# Altium project CT310高端控制盒基板电路V1.1.PrjPcb (part 1 of 2)
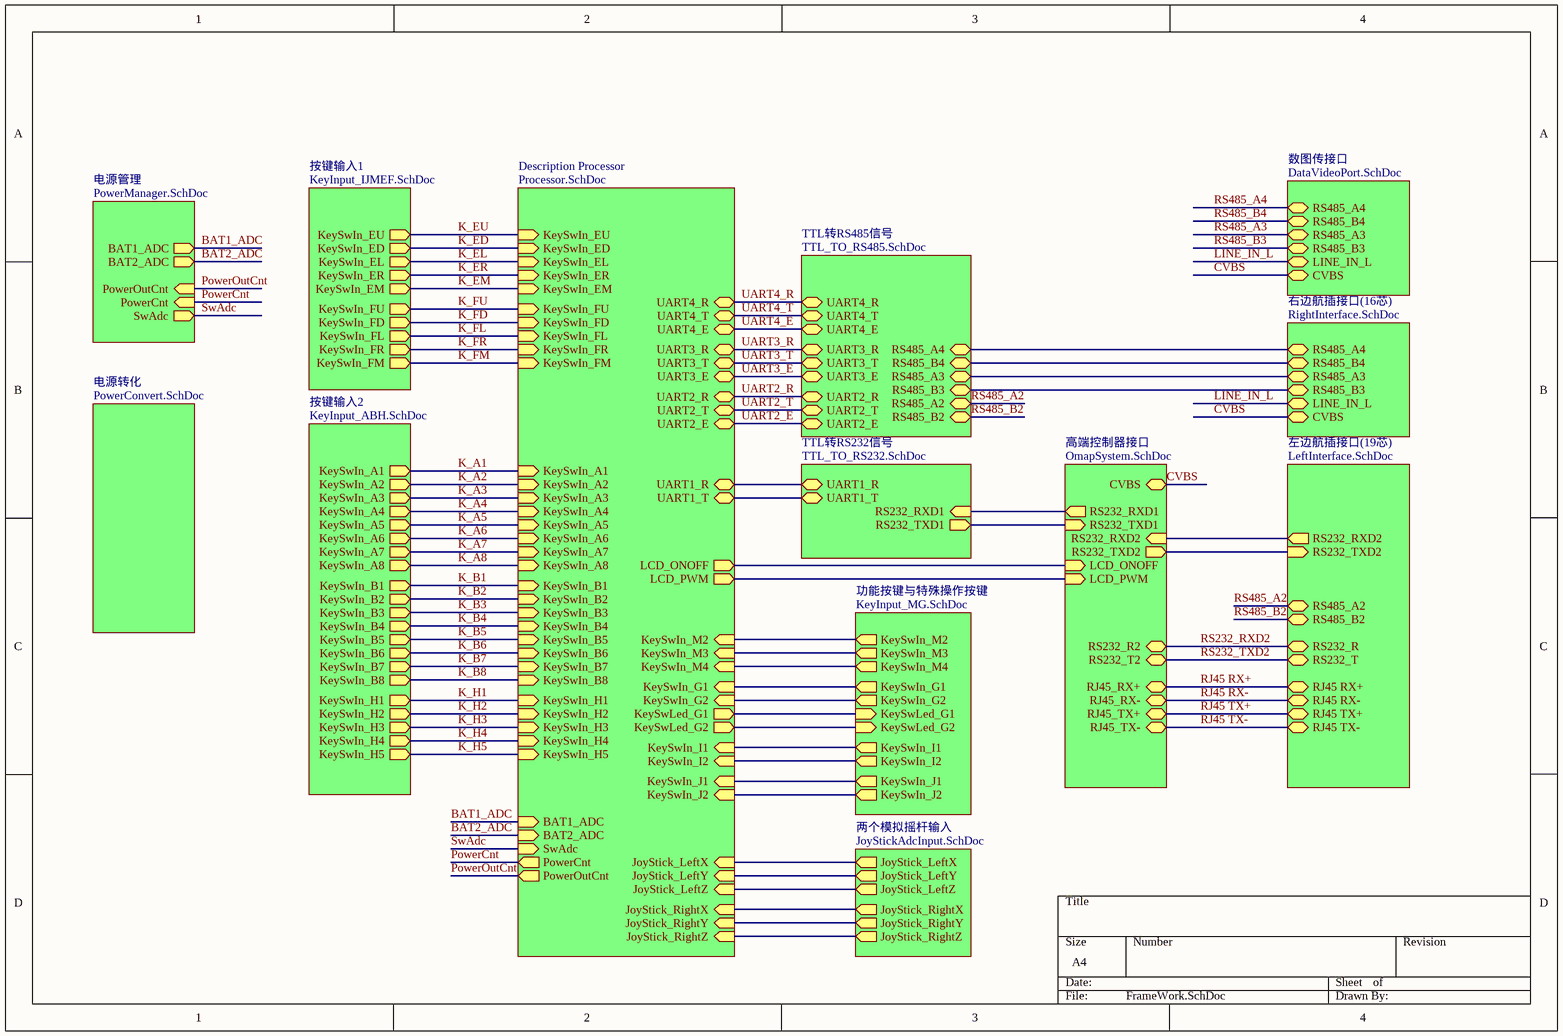
[diagram p0: FrameWork.SchDoc]
13 sheets, 273 parts. Net scope: global (net labels, ports and power ports of the same name join across sheets).
Board file: CT310高端控制盒基板电路V1.1.PcbDoc
Sheets:
  FrameWork.SchDoc
    Description Processor = Processor.SchDoc
    按键输入1 = KeyInput_IJMEF.SchDoc
    两个模拟摇杆输入 = JoyStickAdcInput.SchDoc
    按键输入2 = KeyInput_ABH.SchDoc
    高端控制器接口 = OmapSystem.SchDoc
    功能按键与特殊操作按键 = KeyInput_MG.SchDoc
    电源管理 = PowerManager.SchDoc
    左边航插接口(19芯) = LeftInterface.SchDoc
    TTL转RS232信号 = TTL_TO_RS232.SchDoc
    TTL转RS485信号 = TTL_TO_RS485.SchDoc
    电源转化 = PowerConvert.SchDoc
    数图传接口 = DataVideoPort.SchDoc

## Sheet FrameWork.SchDoc
size A4

### Sub-sheets
Description Processor = Processor.SchDoc: KeySwIn_EU (in), KeySwIn_ED (in), KeySwIn_EL (in), KeySwIn_ER (in), KeySwIn_EM (in), KeySwIn_FU (in), KeySwIn_FD (in), KeySwIn_FL (in), KeySwIn_FR (in), KeySwIn_FM (in), KeySwIn_A2 (in), KeySwIn_A3 (in), KeySwIn_A4 (in), KeySwIn_A5 (in), KeySwIn_A6 (in), KeySwIn_A7 (in), KeySwIn_A8 (in), KeySwIn_A1 (in), KeySwIn_B2 (in), KeySwIn_B3 (in), KeySwIn_B4 (in), KeySwIn_B5 (in), KeySwIn_B6 (in), KeySwIn_B7 (in), KeySwIn_B8 (in), KeySwIn_B1 (in), KeySwIn_H2 (in), KeySwIn_H3 (in), KeySwIn_H4 (in), KeySwIn_H5 (in), KeySwIn_H1 (in), JoyStick_LeftX (in), JoyStick_LeftY (in), JoyStick_LeftZ (in), JoyStick_RightX (in), JoyStick_RightY (in), JoyStick_RightZ (in), UART1_T (bidir), UART1_R (bidir), UART3_T (bidir), UART3_R (bidir), UART3_E (bidir), UART2_T (bidir), UART2_R (bidir), UART4_T (bidir), UART4_R (bidir), UART4_E (bidir), UART2_E (bidir), BAT2_ADC (in), BAT1_ADC (in), KeySwIn_M3 (in), KeySwIn_M4 (in), KeySwIn_M2 (in), KeySwIn_G1 (in), KeySwIn_G2 (in), KeySwLed_G1 (out), KeySwLed_G2 (out), KeySwIn_I1 (in), KeySwIn_I2 (in), KeySwIn_J1 (in), KeySwIn_J2 (in), SwAdc (in), PowerCnt (out), LCD_ONOFF (out), LCD_PWM (out), PowerOutCnt (out)
TTL转RS232信号 = TTL_TO_RS232.SchDoc: RS232_RXD1 (in), UART1_T (bidir), UART1_R (bidir), RS232_TXD1 (out)
TTL转RS485信号 = TTL_TO_RS485.SchDoc: UART3_T (bidir), UART3_R (bidir), RS485_B3 (bidir), RS485_A3 (bidir), RS485_B4 (bidir), RS485_A4 (bidir), UART3_E (bidir), UART2_T (bidir), UART2_R (bidir), UART4_T (bidir), UART4_R (bidir), UART4_E (bidir), UART2_E (bidir), RS485_B2 (bidir), RS485_A2 (bidir)
两个模拟摇杆输入 = JoyStickAdcInput.SchDoc: JoyStick_LeftX (out), JoyStick_LeftY (out), JoyStick_LeftZ (out), JoyStick_RightX (out), JoyStick_RightY (out), JoyStick_RightZ (out)
功能按键与特殊操作按键 = KeyInput_MG.SchDoc: KeySwIn_M2 (out), KeySwIn_M3 (out), KeySwIn_M4 (out), KeySwIn_G2 (out), KeySwLed_G1 (in), KeySwIn_G1 (out), KeySwLed_G2 (in), KeySwIn_I1 (out), KeySwIn_I2 (out), KeySwIn_J1 (out), KeySwIn_J2 (out)
右边航插接口(16芯) = RightInterface.SchDoc (file not in this document): RS485_B4 (bidir), RS485_A4 (bidir), RS485_B3 (bidir), RS485_A3 (bidir), CVBS (bidir), LINE_IN_L (bidir)
左边航插接口(19芯) = LeftInterface.SchDoc: RS232_T (bidir), RS232_R (bidir), RS485_B2 (bidir), RS485_A2 (bidir), RJ45 RX+ (bidir), RJ45 TX+ (bidir), RJ45 RX- (bidir), RJ45 TX- (bidir), RS232_RXD2 (out), RS232_TXD2 (in)
按键输入1 = KeyInput_IJMEF.SchDoc: KeySwIn_EU (out), KeySwIn_ED (out), KeySwIn_EL (out), KeySwIn_ER (out), KeySwIn_EM (out), KeySwIn_FU (out), KeySwIn_FD (out), KeySwIn_FL (out), KeySwIn_FR (out), KeySwIn_FM (out)
按键输入2 = KeyInput_ABH.SchDoc: KeySwIn_A1 (out), KeySwIn_A2 (out), KeySwIn_A3 (out), KeySwIn_A4 (out), KeySwIn_A5 (out), KeySwIn_A6 (out), KeySwIn_A7 (out), KeySwIn_A8 (out), KeySwIn_B1 (out), KeySwIn_B2 (out), KeySwIn_B3 (out), KeySwIn_B4 (out), KeySwIn_B5 (out), KeySwIn_B6 (out), KeySwIn_B7 (out), KeySwIn_B8 (out), KeySwIn_H1 (out), KeySwIn_H2 (out), KeySwIn_H3 (out), KeySwIn_H4 (out), KeySwIn_H5 (out)
数图传接口 = DataVideoPort.SchDoc: RS485_B4 (bidir), RS485_A4 (bidir), RS485_B3 (bidir), RS485_A3 (bidir), CVBS (bidir), LINE_IN_L (bidir)
电源管理 = PowerManager.SchDoc: BAT2_ADC (out), BAT1_ADC (out), PowerCnt (in), SwAdc (out), PowerOutCnt (in)
电源转化 = PowerConvert.SchDoc: no entries
高端控制器接口 = OmapSystem.SchDoc: RJ45_RX+ (bidir), RJ45_TX+ (bidir), RJ45_RX- (bidir), RJ45_TX- (bidir), RS232_T2 (bidir), RS232_R2 (bidir), RS232_RXD1 (out), RS232_TXD1 (in), CVBS (bidir), LCD_ONOFF (in), LCD_PWM (in), RS232_RXD2 (in), RS232_TXD2 (out)

### Nets
BAT1_ADC: sheet Description Processor/BAT1_ADC, sheet 电源管理/BAT1_ADC
BAT2_ADC: sheet Description Processor/BAT2_ADC, sheet 电源管理/BAT2_ADC
CVBS: sheet 高端控制器接口/CVBS, sheet 右边航插接口(16芯)/CVBS, sheet 数图传接口/CVBS
K_A1: sheet Description Processor/KeySwIn_A1, sheet 按键输入2/KeySwIn_A1
K_A2: sheet Description Processor/KeySwIn_A2, sheet 按键输入2/KeySwIn_A2
K_A3: sheet Description Processor/KeySwIn_A3, sheet 按键输入2/KeySwIn_A3
K_A4: sheet Description Processor/KeySwIn_A4, sheet 按键输入2/KeySwIn_A4
K_A5: sheet Description Processor/KeySwIn_A5, sheet 按键输入2/KeySwIn_A5
K_A6: sheet Description Processor/KeySwIn_A6, sheet 按键输入2/KeySwIn_A6
K_A7: sheet Description Processor/KeySwIn_A7, sheet 按键输入2/KeySwIn_A7
K_A8: sheet Description Processor/KeySwIn_A8, sheet 按键输入2/KeySwIn_A8
K_B1: sheet Description Processor/KeySwIn_B1, sheet 按键输入2/KeySwIn_B1
K_B2: sheet Description Processor/KeySwIn_B2, sheet 按键输入2/KeySwIn_B2
K_B3: sheet Description Processor/KeySwIn_B3, sheet 按键输入2/KeySwIn_B3
K_B4: sheet Description Processor/KeySwIn_B4, sheet 按键输入2/KeySwIn_B4
K_B5: sheet Description Processor/KeySwIn_B5, sheet 按键输入2/KeySwIn_B5
K_B6: sheet Description Processor/KeySwIn_B6, sheet 按键输入2/KeySwIn_B6
K_B7: sheet Description Processor/KeySwIn_B7, sheet 按键输入2/KeySwIn_B7
K_B8: sheet Description Processor/KeySwIn_B8, sheet 按键输入2/KeySwIn_B8
K_ED: sheet Description Processor/KeySwIn_ED, sheet 按键输入1/KeySwIn_ED
K_EL: sheet Description Processor/KeySwIn_EL, sheet 按键输入1/KeySwIn_EL
K_EM: sheet Description Processor/KeySwIn_EM, sheet 按键输入1/KeySwIn_EM
K_ER: sheet Description Processor/KeySwIn_ER, sheet 按键输入1/KeySwIn_ER
K_EU: sheet Description Processor/KeySwIn_EU, sheet 按键输入1/KeySwIn_EU
K_FD: sheet Description Processor/KeySwIn_FD, sheet 按键输入1/KeySwIn_FD
K_FL: sheet Description Processor/KeySwIn_FL, sheet 按键输入1/KeySwIn_FL
K_FM: sheet Description Processor/KeySwIn_FM, sheet 按键输入1/KeySwIn_FM
K_FR: sheet Description Processor/KeySwIn_FR, sheet 按键输入1/KeySwIn_FR
K_FU: sheet Description Processor/KeySwIn_FU, sheet 按键输入1/KeySwIn_FU
K_H1: sheet Description Processor/KeySwIn_H1, sheet 按键输入2/KeySwIn_H1
K_H2: sheet Description Processor/KeySwIn_H2, sheet 按键输入2/KeySwIn_H2
K_H3: sheet Description Processor/KeySwIn_H3, sheet 按键输入2/KeySwIn_H3
K_H4: sheet Description Processor/KeySwIn_H4, sheet 按键输入2/KeySwIn_H4
K_H5: sheet Description Processor/KeySwIn_H5, sheet 按键输入2/KeySwIn_H5
LINE_IN_L: sheet 右边航插接口(16芯)/LINE_IN_L, sheet 数图传接口/LINE_IN_L
PowerCnt: sheet Description Processor/PowerCnt, sheet 电源管理/PowerCnt
PowerOutCnt: sheet Description Processor/PowerOutCnt, sheet 电源管理/PowerOutCnt
RJ45 RX+: sheet 高端控制器接口/RJ45_RX+, sheet 左边航插接口(19芯)/RJ45 RX+
RJ45 RX-: sheet 高端控制器接口/RJ45_RX-, sheet 左边航插接口(19芯)/RJ45 RX-
RJ45 TX+: sheet 高端控制器接口/RJ45_TX+, sheet 左边航插接口(19芯)/RJ45 TX+
RJ45 TX-: sheet 高端控制器接口/RJ45_TX-, sheet 左边航插接口(19芯)/RJ45 TX-
RS232_RXD2: sheet 高端控制器接口/RS232_R2, sheet 左边航插接口(19芯)/RS232_R
RS232_TXD2: sheet 高端控制器接口/RS232_T2, sheet 左边航插接口(19芯)/RS232_T
RS485_A2: sheet 左边航插接口(19芯)/RS485_A2, sheet TTL转RS485信号/RS485_A2
RS485_B2: sheet 左边航插接口(19芯)/RS485_B2, sheet TTL转RS485信号/RS485_B2
SwAdc: sheet Description Processor/SwAdc, sheet 电源管理/SwAdc
UART2_E: sheet Description Processor/UART2_E, sheet TTL转RS485信号/UART2_E
UART2_R: sheet Description Processor/UART2_R, sheet TTL转RS485信号/UART2_R
UART2_T: sheet Description Processor/UART2_T, sheet TTL转RS485信号/UART2_T
UART3_E: sheet Description Processor/UART3_E, sheet TTL转RS485信号/UART3_E
UART3_R: sheet Description Processor/UART3_R, sheet TTL转RS485信号/UART3_R
UART3_T: sheet Description Processor/UART3_T, sheet TTL转RS485信号/UART3_T
UART4_E: sheet Description Processor/UART4_E, sheet TTL转RS485信号/UART4_E
UART4_R: sheet Description Processor/UART4_R, sheet TTL转RS485信号/UART4_R
UART4_T: sheet Description Processor/UART4_T, sheet TTL转RS485信号/UART4_T
(unnamed): sheet Description Processor/JoyStick_LeftX, sheet 两个模拟摇杆输入/JoyStick_LeftX
(unnamed): sheet Description Processor/JoyStick_LeftY, sheet 两个模拟摇杆输入/JoyStick_LeftY
(unnamed): sheet Description Processor/JoyStick_LeftZ, sheet 两个模拟摇杆输入/JoyStick_LeftZ
(unnamed): sheet Description Processor/JoyStick_RightX, sheet 两个模拟摇杆输入/JoyStick_RightX
(unnamed): sheet Description Processor/JoyStick_RightY, sheet 两个模拟摇杆输入/JoyStick_RightY
(unnamed): sheet Description Processor/JoyStick_RightZ, sheet 两个模拟摇杆输入/JoyStick_RightZ
(unnamed): sheet Description Processor/UART1_T, sheet TTL转RS232信号/UART1_T
(unnamed): sheet Description Processor/UART1_R, sheet TTL转RS232信号/UART1_R
(unnamed): sheet Description Processor/KeySwIn_M3, sheet 功能按键与特殊操作按键/KeySwIn_M3
(unnamed): sheet Description Processor/KeySwIn_M4, sheet 功能按键与特殊操作按键/KeySwIn_M4
(unnamed): sheet Description Processor/KeySwIn_M2, sheet 功能按键与特殊操作按键/KeySwIn_M2
(unnamed): sheet Description Processor/KeySwIn_G1, sheet 功能按键与特殊操作按键/KeySwIn_G1
(unnamed): sheet Description Processor/KeySwIn_G2, sheet 功能按键与特殊操作按键/KeySwIn_G2
(unnamed): sheet Description Processor/KeySwLed_G1, sheet 功能按键与特殊操作按键/KeySwLed_G1
(unnamed): sheet Description Processor/KeySwLed_G2, sheet 功能按键与特殊操作按键/KeySwLed_G2
(unnamed): sheet Description Processor/KeySwIn_I1, sheet 功能按键与特殊操作按键/KeySwIn_I1
(unnamed): sheet Description Processor/KeySwIn_I2, sheet 功能按键与特殊操作按键/KeySwIn_I2
(unnamed): sheet Description Processor/KeySwIn_J1, sheet 功能按键与特殊操作按键/KeySwIn_J1
(unnamed): sheet Description Processor/KeySwIn_J2, sheet 功能按键与特殊操作按键/KeySwIn_J2
(unnamed): sheet Description Processor/LCD_ONOFF, sheet 高端控制器接口/LCD_ONOFF
(unnamed): sheet Description Processor/LCD_PWM, sheet 高端控制器接口/LCD_PWM
(unnamed): sheet 高端控制器接口/RS232_RXD1, sheet TTL转RS232信号/RS232_RXD1
(unnamed): sheet 高端控制器接口/RS232_TXD1, sheet TTL转RS232信号/RS232_TXD1
(unnamed): sheet 高端控制器接口/RS232_RXD2, sheet 左边航插接口(19芯)/RS232_RXD2
(unnamed): sheet 高端控制器接口/RS232_TXD2, sheet 左边航插接口(19芯)/RS232_TXD2
(unnamed): sheet 右边航插接口(16芯)/RS485_B4, sheet TTL转RS485信号/RS485_B4
(unnamed): sheet 右边航插接口(16芯)/RS485_A4, sheet TTL转RS485信号/RS485_A4
(unnamed): sheet 右边航插接口(16芯)/RS485_B3, sheet TTL转RS485信号/RS485_B3
(unnamed): sheet 右边航插接口(16芯)/RS485_A3, sheet TTL转RS485信号/RS485_A3

## Sheet Processor.SchDoc
size B
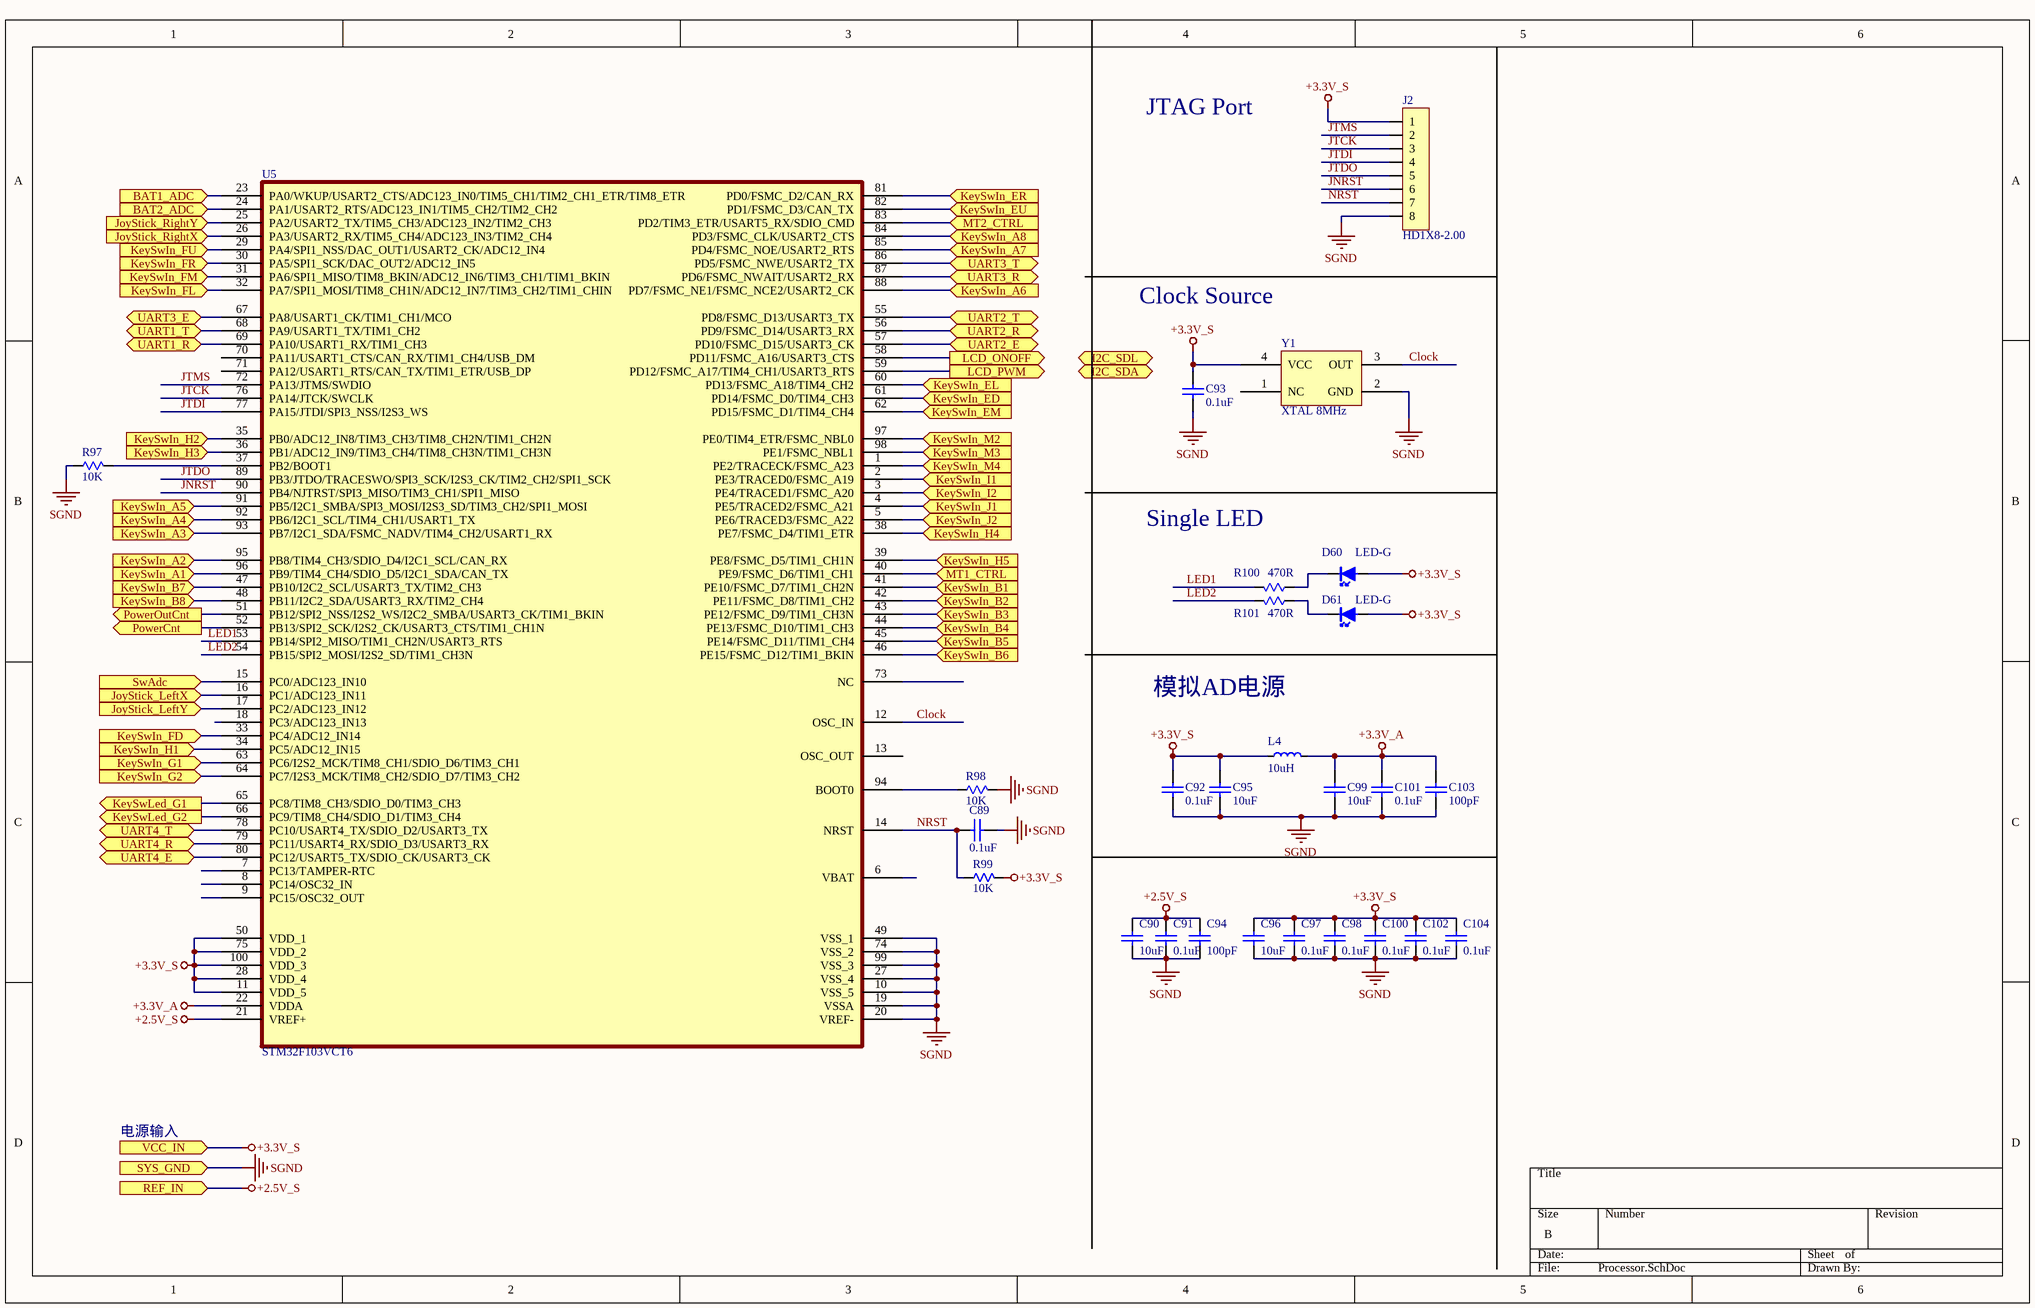
[diagram p1: Processor.SchDoc]

### Parts
C89  0.1uF  [C0603]
C90  10uF  [C0805]
C91  0.1uF  [C0603]
C92  0.1uF  [C0603]
C93  0.1uF  [C0603]
C94  100pF  [C0603]
C95  10uF  [C0805]
C96  10uF  [C0805]
C97  0.1uF  [C0603]
C98  0.1uF  [C0603]
C99  10uF  [C0805]
C100  0.1uF  [C0603]
C101  0.1uF  [C0603]
C102  0.1uF  [C0603]
C103  100pF  [C0603]
C104  0.1uF  [C0603]
D60  LED-G  [LED0805]
D61  LED-G  [LED0805]
J2  HD1X8-2.00  [SHD1X8-2.00]
L4  10uH  [L0603-C]
R97  10K  [R0603]
R98  10K  [R0603]
R99  10K  [R0603]
R100  470R  [R0805]
R101  470R  [R0805]
U5  STM32F103VCT6  [STM32F103VCT6]
Y1  XTAL 8MHz  [XTAL 5.0X7.0-SM]

### Ports
BAT1_ADC (in), BAT2_ADC (in), I2C_SDA (bidir), I2C_SDL (bidir), JoyStick_LeftX (in), JoyStick_LeftY (in), JoyStick_RightX (in), JoyStick_RightY (in), KeySwIn_A1 (in), KeySwIn_A2 (in), KeySwIn_A3 (in), KeySwIn_A4 (in), KeySwIn_A5 (in), KeySwIn_A6 (in), KeySwIn_A7 (in), KeySwIn_A8 (in), KeySwIn_B1 (in), KeySwIn_B2 (in), KeySwIn_B3 (in), KeySwIn_B4 (in), KeySwIn_B5 (in), KeySwIn_B6 (in), KeySwIn_B7 (in), KeySwIn_B8 (in), KeySwIn_ED (in), KeySwIn_EL (in), KeySwIn_EM (in), KeySwIn_ER (in), KeySwIn_EU (in), KeySwIn_FD (in), KeySwIn_FL (in), KeySwIn_FM (in), KeySwIn_FR (in), KeySwIn_FU (in), KeySwIn_G1 (in), KeySwIn_G2 (in), KeySwIn_H1 (in), KeySwIn_H2 (in), KeySwIn_H3 (in), KeySwIn_H4 (in), KeySwIn_H5 (in), KeySwIn_I1 (in), KeySwIn_I2 (in), KeySwIn_J1 (in), KeySwIn_J2 (in), KeySwIn_M2 (in), KeySwIn_M3 (in), KeySwIn_M4 (in), KeySwLed_G1 (out), KeySwLed_G2 (out), LCD_ONOFF (out), LCD_PWM (out), MT1_CTRL (in), MT2_CTRL (in), PowerCnt (out), PowerOutCnt (out), REF_IN, SwAdc (in), SYS_GND, UART1_R (bidir), UART1_T (bidir), UART2_E (bidir), UART2_R (bidir), UART2_T (bidir), UART3_E (bidir), UART3_R (bidir), UART3_T (bidir), UART4_E (bidir), UART4_R (bidir), UART4_T (bidir), VCC_IN

### Nets
+2.5V_S: C90.1 C91.1 C94.1 U5.21(VREF+) ; port REF_IN
+3.3V_A: C99.2 C101.2 C103.2 L4.2 U5.22(VDDA)
+3.3V_S: C92.2 C93.2 C95.2 C96.1 C97.1 C98.1 C100.1 C102.1 C104.1 D60.1(A) D61.1(A) J2.1 L4.1 R99.1 U5.11(VDD_5) U5.28(VDD_4) U5.50(VDD_1) U5.75(VDD_2) U5.100(VDD_3) Y1.4(VCC) ; port VCC_IN
SGND: C89.2 C90.2 C91.2 C92.1 C93.1 C94.2 C95.1 C96.2 C97.2 C98.2 C99.1 C100.2 C101.1 C102.2 C103.1 C104.2 J2.8 R97.2 R98.1 U5.10(VSS_5) U5.19(VSSA) U5.20(VREF-) U5.27(VSS_4) U5.49(VSS_1) U5.74(VSS_2) U5.99(VSS_3) Y1.2(GND) ; port SYS_GND
BAT1_ADC: U5.23(PA0/WKUP/USART2_CTS/ADC123_IN0/TIM5_CH1/TIM2_CH1_ETR/TIM8_ETR) ; port BAT1_ADC
BAT2_ADC: U5.24(PA1/USART2_RTS/ADC123_IN1/TIM5_CH2/TIM2_CH2) ; port BAT2_ADC
Clock: U5.12(OSC_IN) Y1.3(OUT)
JNRST: J2.6 U5.90(PB4/NJTRST/SPI3_MISO/TIM3_CH1/SPI1_MISO)
JoyStick_LeftX: U5.16(PC1/ADC123_IN11) ; port JoyStick_LeftX
JoyStick_LeftY: U5.17(PC2/ADC123_IN12) ; port JoyStick_LeftY
JoyStick_RightX: U5.26(PA3/USART2_RX/TIM5_CH4/ADC123_IN3/TIM2_CH4) ; port JoyStick_RightX
JoyStick_RightY: U5.25(PA2/USART2_TX/TIM5_CH3/ADC123_IN2/TIM2_CH3) ; port JoyStick_RightY
JTCK: J2.3 U5.76(PA14/JTCK/SWCLK)
JTDI: J2.4 U5.77(PA15/JTDI/SPI3_NSS/I2S3_WS)
JTDO: J2.5 U5.89(PB3/JTDO/TRACESWO/SPI3_SCK/I2S3_CK/TIM2_CH2/SPI1_SCK)
JTMS: J2.2 U5.72(PA13/JTMS/SWDIO)
KeySwIn_ED: U5.61(PD14/FSMC_D0/TIM4_CH3) ; port KeySwIn_ED
KeySwIn_EL: U5.60(PD13/FSMC_A18/TIM4_CH2) ; port KeySwIn_EL
KeySwIn_EM: U5.62(PD15/FSMC_D1/TIM4_CH4) ; port KeySwIn_EM
KeySwIn_ER: U5.81(PD0/FSMC_D2/CAN_RX) ; port KeySwIn_ER
KeySwIn_EU: U5.82(PD1/FSMC_D3/CAN_TX) ; port KeySwIn_EU
KeySwIn_FD: U5.33(PC4/ADC12_IN14) ; port KeySwIn_FD
KeySwIn_FL: U5.32(PA7/SPI1_MOSI/TIM8_CH1N/ADC12_IN7/TIM3_CH2/TIM1_CHIN) ; port KeySwIn_FL
KeySwIn_FM: U5.31(PA6/SPI1_MISO/TIM8_BKIN/ADC12_IN6/TIM3_CH1/TIM1_BKIN) ; port KeySwIn_FM
KeySwIn_FR: U5.30(PA5/SPI1_SCK/DAC_OUT2/ADC12_IN5) ; port KeySwIn_FR
KeySwIn_FU: U5.29(PA4/SPI1_NSS/DAC_OUT1/USART2_CK/ADC12_IN4) ; port KeySwIn_FU
KeySwIn_G1: U5.63(PC6/I2S2_MCK/TIM8_CH1/SDIO_D6/TIM3_CH1) ; port KeySwIn_G1
KeySwIn_G2: U5.64(PC7/I2S3_MCK/TIM8_CH2/SDIO_D7/TIM3_CH2) ; port KeySwIn_G2
KeySwIn_H1: U5.34(PC5/ADC12_IN15) ; port KeySwIn_H1
KeySwIn_H2: U5.35(PB0/ADC12_IN8/TIM3_CH3/TIM8_CH2N/TIM1_CH2N) ; port KeySwIn_H2
KeySwIn_H3: U5.36(PB1/ADC12_IN9/TIM3_CH4/TIM8_CH3N/TIM1_CH3N) ; port KeySwIn_H3
KeySwIn_H4: U5.38(PE7/FSMC_D4/TIM1_ETR) ; port KeySwIn_H4
KeySwIn_H5: U5.39(PE8/FSMC_D5/TIM1_CH1N) ; port KeySwIn_H5
KeySwIn_I1: U5.2(PE3/TRACED0/FSMC_A19) ; port KeySwIn_I1
KeySwIn_I2: U5.3(PE4/TRACED1/FSMC_A20) ; port KeySwIn_I2
KeySwIn_J1: U5.4(PE5/TRACED2/FSMC_A21) ; port KeySwIn_J1
KeySwIn_J2: U5.5(PE6/TRACED3/FSMC_A22) ; port KeySwIn_J2
KeySwIn_M2: U5.97(PE0/TIM4_ETR/FSMC_NBL0) ; port KeySwIn_M2
KeySwIn_M3: U5.98(PE1/FSMC_NBL1) ; port KeySwIn_M3
KeySwIn_M4: U5.1(PE2/TRACECK/FSMC_A23) ; port KeySwIn_M4
KeySwLed_G1: U5.65(PC8/TIM8_CH3/SDIO_D0/TIM3_CH3) ; port KeySwLed_G1
KeySwLed_G2: U5.66(PC9/TIM8_CH4/SDIO_D1/TIM3_CH4) ; port KeySwLed_G2
KJ_A1: U5.96(PB9/TIM4_CH4/SDIO_D5/I2C1_SDA/CAN_TX) ; port KeySwIn_A1
KJ_A2: U5.95(PB8/TIM4_CH3/SDIO_D4/I2C1_SCL/CAN_RX) ; port KeySwIn_A2
KJ_A3: U5.93(PB7/I2C1_SDA/FSMC_NADV/TIM4_CH2/USART1_RX) ; port KeySwIn_A3
KJ_A4: U5.92(PB6/I2C1_SCL/TIM4_CH1/USART1_TX) ; port KeySwIn_A4
KJ_A5: U5.91(PB5/I2C1_SMBA/SPI3_MOSI/I2S3_SD/TIM3_CH2/SPI1_MOSI) ; port KeySwIn_A5
KJ_A6: U5.88(PD7/FSMC_NE1/FSMC_NCE2/USART2_CK) ; port KeySwIn_A6
KJ_A7: U5.85(PD4/FSMC_NOE/USART2_RTS) ; port KeySwIn_A7
KJ_A8: U5.84(PD3/FSMC_CLK/USART2_CTS) ; port KeySwIn_A8
KJ_B1: U5.41(PE10/FSMC_D7/TIM1_CH2N) ; port KeySwIn_B1
KJ_B2: U5.42(PE11/FSMC_D8/TIM1_CH2) ; port KeySwIn_B2
KJ_B3: U5.43(PE12/FSMC_D9/TIM1_CH3N) ; port KeySwIn_B3
KJ_B4: U5.44(PE13/FSMC_D10/TIM1_CH3) ; port KeySwIn_B4
KJ_B5: U5.45(PE14/FSMC_D11/TIM1_CH4) ; port KeySwIn_B5
KJ_B6: U5.46(PE15/FSMC_D12/TIM1_BKIN) ; port KeySwIn_B6
KJ_B7: U5.47(PB10/I2C2_SCL/USART3_TX/TIM2_CH3) ; port KeySwIn_B7
KJ_B8: U5.48(PB11/I2C2_SDA/USART3_RX/TIM2_CH4) ; port KeySwIn_B8
LCD_ONOFF: U5.58(PD11/FSMC_A16/USART3_CTS) ; port LCD_ONOFF
LCD_PWM: U5.59(PD12/FSMC_A17/TIM4_CH1/USART3_RTS) ; port LCD_PWM
LED1: R100.1 U5.53(PB14/SPI2_MISO/TIM1_CH2N/USART3_RTS)
LED2: R101.1 U5.54(PB15/SPI2_MOSI/I2S2_SD/TIM1_CH3N)
MT1_CTRL: U5.40(PE9/FSMC_D6/TIM1_CH1) ; port MT1_CTRL
MT2_CTRL: U5.83(PD2/TIM3_ETR/USART5_RX/SDIO_CMD) ; port MT2_CTRL
NRST: C89.1 J2.7 R99.2 U5.14(NRST)
PowerCnt: U5.52(PB13/SPI2_SCK/I2S2_CK/USART3_CTS/TIM1_CH1N) ; port PowerCnt
PowerOutCnt: U5.51(PB12/SPI2_NSS/I2S2_WS/I2C2_SMBA/USART3_CK/TIM1_BKIN) ; port PowerOutCnt
SwAdc: U5.15(PC0/ADC123_IN10) ; port SwAdc
UART1_R: U5.69(PA10/USART1_RX/TIM1_CH3) ; port UART1_R
UART1_T: U5.68(PA9/USART1_TX/TIM1_CH2) ; port UART1_T
UART2_E: U5.57(PD10/FSMC_D15/USART3_CK) ; port UART2_E
UART2_R: U5.56(PD9/FSMC_D14/USART3_RX) ; port UART2_R
UART2_T: U5.55(PD8/FSMC_D13/USART3_TX) ; port UART2_T
UART3_E: U5.67(PA8/USART1_CK/TIM1_CH1/MCO) ; port UART3_E
UART3_R: U5.87(PD6/FSMC_NWAIT/USART2_RX) ; port UART3_R
UART3_T: U5.86(PD5/FSMC_NWE/USART2_TX) ; port UART3_T
UART4_E: U5.80(PC12/USART5_TX/SDIO_CK/USART3_CK) ; port UART4_E
UART4_R: U5.79(PC11/USART4_RX/SDIO_D3/USART3_RX) ; port UART4_R
UART4_T: U5.78(PC10/USART4_TX/SDIO_D2/USART3_TX) ; port UART4_T
NetD60_2: D60.2(K) R100.2
NetD61_2: D61.2(K) R101.2
NetR97_1: R97.1 U5.37(PB2/BOOT1)
NetR98_2: R98.2 U5.94(BOOT0)

Not connected (* = marked no-connect by the designer): U5 6(VBAT) 7(PC13/TAMPER-RTC) 8(PC14/OSC32_IN) 9(PC15/OSC32_OUT) 13(OSC_OUT) 18(PC3/ADC123_IN13) 70(PA11/USART1_CTS/CAN_RX/TIM1_CH4/USB_DM) 71(PA12/USART1_RTS/CAN_TX/TIM1_ETR/USB_DP) 73(NC); Y1 1(NC)

### Notes on the sheet
- JTAG Port
- Clock Source
- Single LED
- 模拟AD电源
- 电源输入

### Library data of the parts
C89-C92 C94-C104 = CAP: Published: 8-Jun-2000; LatestRevisionDate: 17-Jul-2002; LatestRevisionNote: Re-released for DXP Platform.; PackageReference: RAD-0.3; Publisher: Altium Limited
  C89 C91 C92 C97 C98 C100-C102 C104: Value: 0.1uF
  C90 C95 C96 C99: Value: 10uF
  C94 C103: Value: 100pF
C93 = Cap: Capacitor; Published: 8-Jun-2000; LatestRevisionDate: 17-Jul-2002; LatestRevisionNote: Re-released for DXP Platform.; PackageReference: RAD-0.3; Publisher: Altium Limited; Value: 0.1uF
D60 D61 = LED
J2 = HEADER1X8
L4 = INDUCTOR: Code_IEC: 1005; Published: 8-Jun-2000; LatestRevisionDate: 17-Jul-2002; LatestRevisionNote: Re-released for DXP Platform.; PackageReference: 0402-A; Publisher: Altium Limited; Code_JEITA: 0402; Value: 10uH
R97-R101 = Res: Resistor; Published: 8-Jun-2000; LatestRevisionDate: 04-Mar-2005; LatestRevisionNote: PCB Footprint replaced.; PackageReference: J1-0603; Publisher: Altium Limited
  R97-R99: Value: 10K
  R100 R101: Value: 470R
Y1 = XTAL

## Sheet KeyInput_IJMEF.SchDoc
size A4
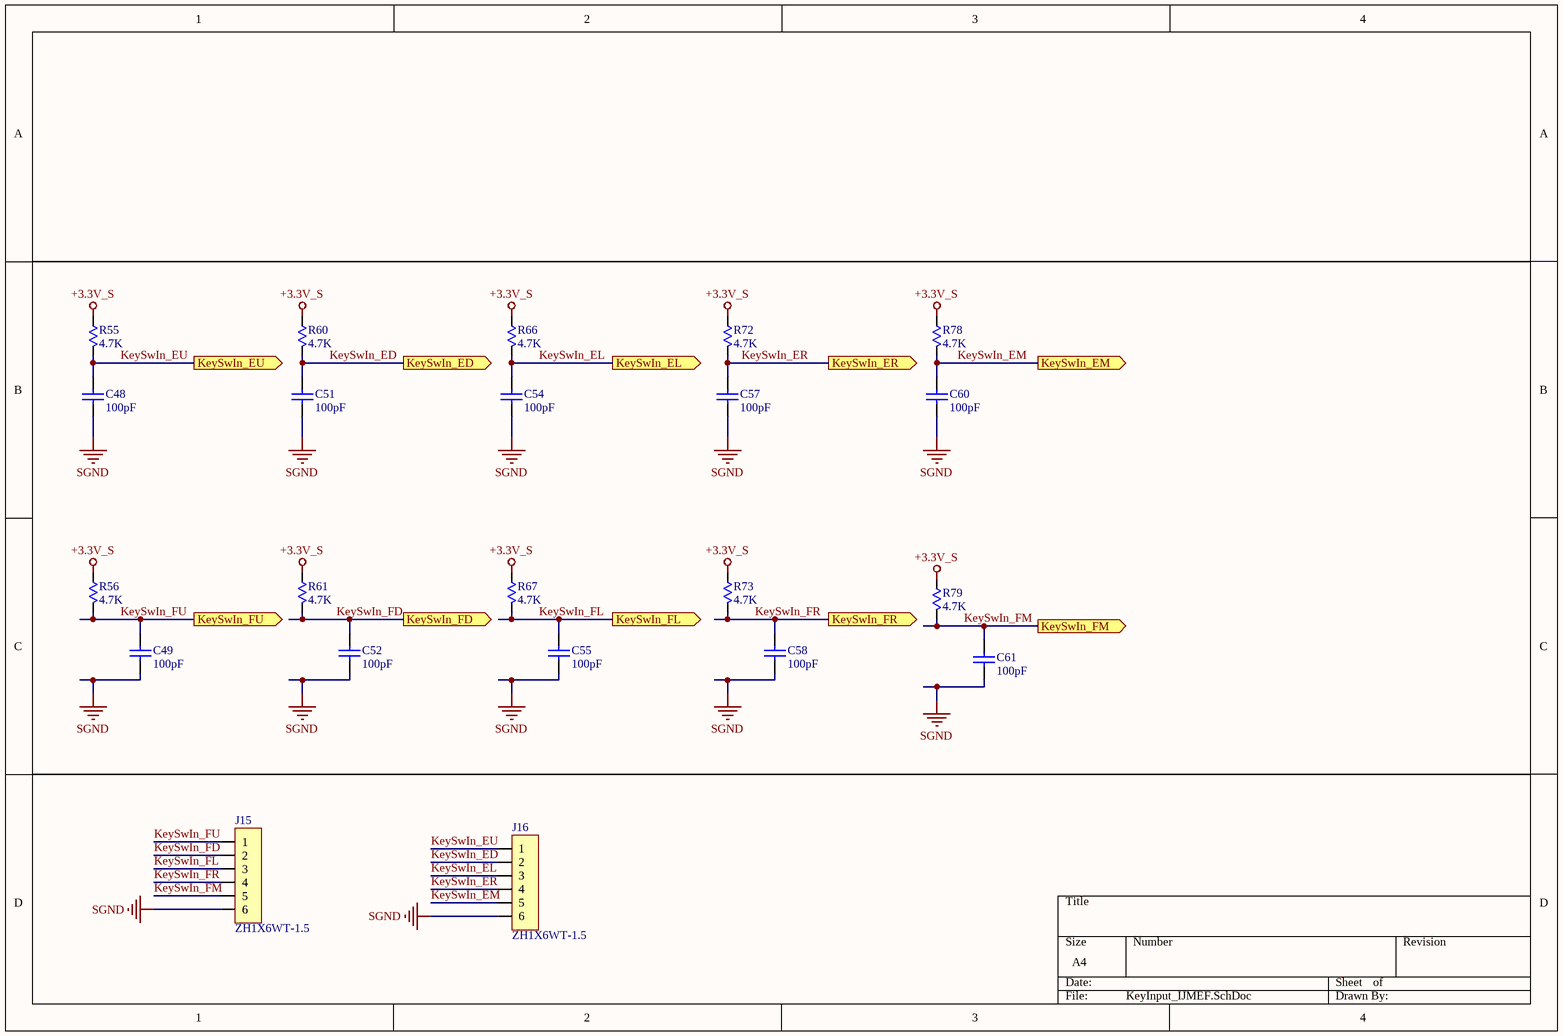
[diagram p2: KeyInput_IJMEF.SchDoc]

### Parts
C48  100pF  [C0805]
C49  100pF  [C0805]
C51  100pF  [C0805]
C52  100pF  [C0805]
C54  100pF  [C0805]
C55  100pF  [C0805]
C57  100pF  [C0805]
C58  100pF  [C0805]
C60  100pF  [C0805]
C61  100pF  [C0805]
J15  ZH1X6WT-1.5  [ZH1X6WT-1.5]
J16  ZH1X6WT-1.5  [ZH1X6WT-1.5]
R55  4.7K  [R0805]
R56  4.7K  [R0805]
R60  4.7K  [R0805]
R61  4.7K  [R0805]
R66  4.7K  [R0805]
R67  4.7K  [R0805]
R72  4.7K  [R0805]
R73  4.7K  [R0805]
R78  4.7K  [R0805]
R79  4.7K  [R0805]

### Ports
KeySwIn_ED (out), KeySwIn_EL (out), KeySwIn_EM (out), KeySwIn_ER (out), KeySwIn_EU (out), KeySwIn_FD (out), KeySwIn_FL (out), KeySwIn_FM (out), KeySwIn_FR (out), KeySwIn_FU (out)

### Nets
+3.3V_S: R55.2 R56.2 R60.2 R61.2 R66.2 R67.2 R72.2 R73.2 R78.2 R79.2
SGND: C48.2 C49.2 C51.2 C52.2 C54.2 C55.2 C57.2 C58.2 C60.2 C61.2 J15.6 J16.6
KeySwIn_ED: C51.1 J16.2 R60.1 ; port KeySwIn_ED
KeySwIn_EL: C54.1 J16.3 R66.1 ; port KeySwIn_EL
KeySwIn_EM: C60.1 J16.5 R78.1 ; port KeySwIn_EM
KeySwIn_ER: C57.1 J16.4 R72.1 ; port KeySwIn_ER
KeySwIn_EU: C48.1 J16.1 R55.1 ; port KeySwIn_EU
KeySwIn_FD: C52.1 J15.2 R61.1 ; port KeySwIn_FD
KeySwIn_FL: C55.1 J15.3 R67.1 ; port KeySwIn_FL
KeySwIn_FM: C61.1 J15.5 R79.1 ; port KeySwIn_FM
KeySwIn_FR: C58.1 J15.4 R73.1 ; port KeySwIn_FR
KeySwIn_FU: C49.1 J15.1 R56.1 ; port KeySwIn_FU

### Library data of the parts
C48 C49 C51 C52 C54 C55 C57 C58 C60 C61 = Cap: Capacitor; Value: 22pF; Published: 8-Jun-2000; Revision: July-2002: Re-released for DXP Platform.; Publisher: Altium Limited
J15 J16 = HEADER1X6
R55 R56 R60 R61 R66 R67 R72 R73 R78 R79 = RES: Resistor; Published: 8-Jun-2000; LatestRevisionDate: 17-Jul-2002; LatestRevisionNote: Re-released for DXP Platform.; PackageReference: AXIAL-0.3; Publisher: Altium Limited; Value: 4.7K

## Sheet JoyStickAdcInput.SchDoc
size A4
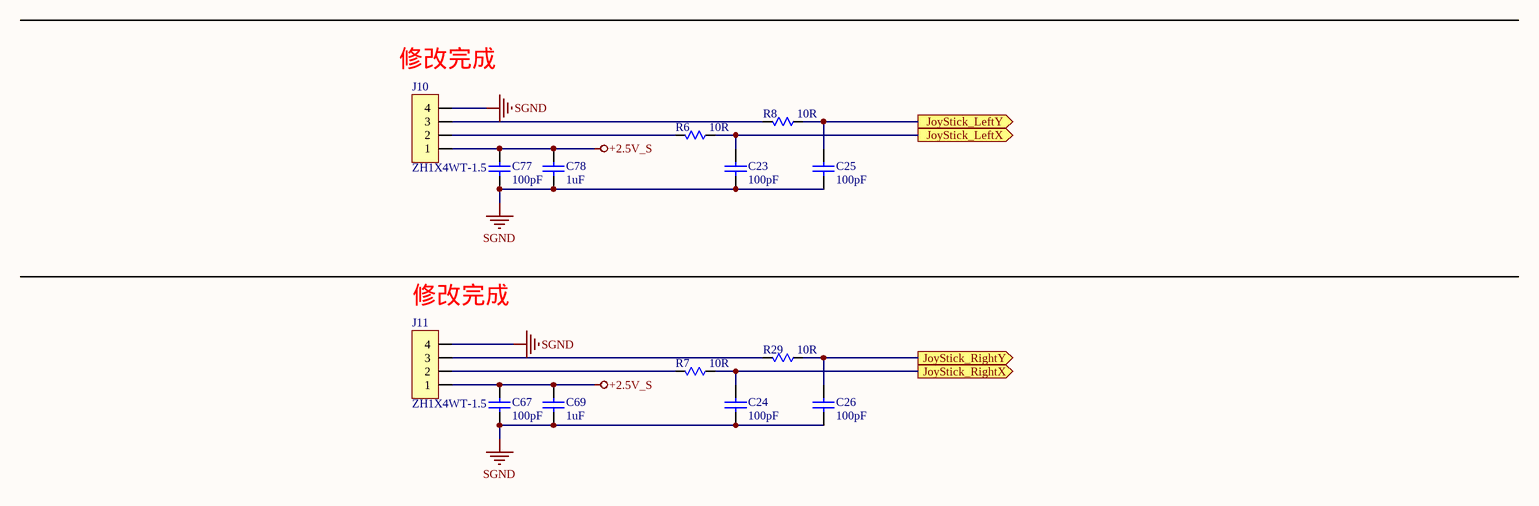
[diagram p3: JoyStickAdcInput.SchDoc]

### Parts
C23  100pF  [C0805]
C24  100pF  [C0805]
C25  100pF  [C0805]
C26  100pF  [C0805]
C67  100pF  [C0805]
C69  1uF  [C0805]
C77  100pF  [C0805]
C78  1uF  [C0805]
J10  ZH1X4WT-1.5  [ZH1X4WT-1.5]
J11  ZH1X4WT-1.5  [ZH1X4WT-1.5]
R6  10R  [R0805]
R7  10R  [R0805]
R8  10R  [R0805]
R29  10R  [R0805]

### Ports
JoyStick_LeftX (out), JoyStick_LeftY (out), JoyStick_RightX (out), JoyStick_RightY (out)

### Nets
+2.5V_S: C67.1 C69.1 C77.1 C78.1 J10.1 J11.1
SGND: C23.2 C24.2 C25.2 C26.2 C67.2 C69.2 C77.2 C78.2 J10.4 J11.4
JoyStick_LeftX: C23.1 R6.1 ; port JoyStick_LeftX
JoyStick_LeftY: C25.1 R8.1 ; port JoyStick_LeftY
JoyStick_RightX: C24.1 R7.1 ; port JoyStick_RightX
JoyStick_RightY: C26.1 R29.1 ; port JoyStick_RightY
NetJ10_2: J10.2 R6.2
NetJ10_3: J10.3 R8.2
NetJ11_2: J11.2 R7.2
NetJ11_3: J11.3 R29.2

### Notes on the sheet
- (near J10) 修改完成
- (near J11) 修改完成

### Library data of the parts
C23-C26 C67 C69 C77 C78 = Cap: Capacitor; Value: 22pF; Published: 8-Jun-2000; Revision: July-2002: Re-released for DXP Platform.; Publisher: Altium Limited
J10 J11 = HEADER1X4
R6-R8 R29 = RES: Resistor; Published: 8-Jun-2000; LatestRevisionDate: 17-Jul-2002; LatestRevisionNote: Re-released for DXP Platform.; PackageReference: AXIAL-0.3; Publisher: Altium Limited; Value: 10R

## Sheet KeyInput_ABH.SchDoc
size A4
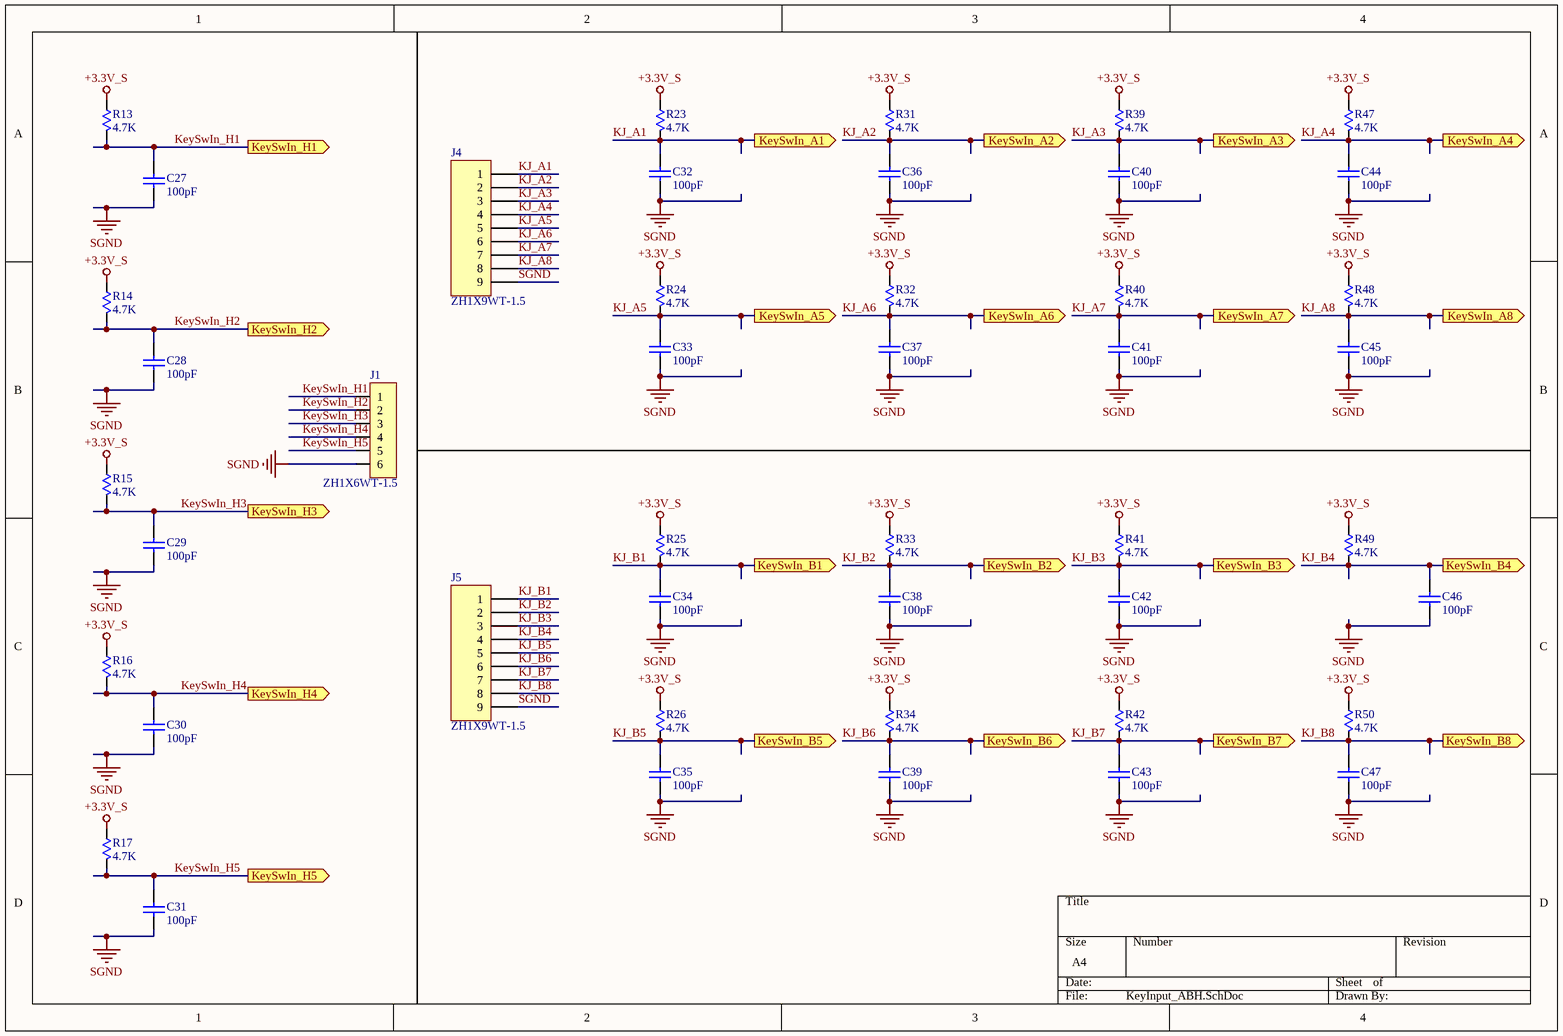
[diagram p4: KeyInput_ABH.SchDoc]

### Parts
C27  100pF  [C0805]
C28  100pF  [C0805]
C29  100pF  [C0805]
C30  100pF  [C0805]
C31  100pF  [C0805]
C32  100pF  [C0805]
C33  100pF  [C0805]
C34  100pF  [C0805]
C35  100pF  [C0805]
C36  100pF  [C0805]
C37  100pF  [C0805]
C38  100pF  [C0805]
C39  100pF  [C0805]
C40  100pF  [C0805]
C41  100pF  [C0805]
C42  100pF  [C0805]
C43  100pF  [C0805]
C44  100pF  [C0805]
C45  100pF  [C0805]
C46  100pF  [C0805]
C47  100pF  [C0805]
J1  ZH1X6WT-1.5  [ZH1X6WT-1.5]
J4  ZH1X9WT-1.5  [ZH1X9WT-1.5]
J5  ZH1X9WT-1.5  [ZH1X9WT-1.5]
R13  4.7K  [R0805]
R14  4.7K  [R0805]
R15  4.7K  [R0805]
R16  4.7K  [R0805]
R17  4.7K  [R0805]
R23  4.7K  [R0805]
R24  4.7K  [R0805]
R25  4.7K  [R0805]
R26  4.7K  [R0805]
R31  4.7K  [R0805]
R32  4.7K  [R0805]
R33  4.7K  [R0805]
R34  4.7K  [R0805]
R39  4.7K  [R0805]
R40  4.7K  [R0805]
R41  4.7K  [R0805]
R42  4.7K  [R0805]
R47  4.7K  [R0805]
R48  4.7K  [R0805]
R49  4.7K  [R0805]
R50  4.7K  [R0805]

### Ports
KeySwIn_A1 (out), KeySwIn_A2 (out), KeySwIn_A3 (out), KeySwIn_A4 (out), KeySwIn_A5 (out), KeySwIn_A6 (out), KeySwIn_A7 (out), KeySwIn_A8 (out), KeySwIn_B1 (out), KeySwIn_B2 (out), KeySwIn_B3 (out), KeySwIn_B4 (out), KeySwIn_B5 (out), KeySwIn_B6 (out), KeySwIn_B7 (out), KeySwIn_B8 (out), KeySwIn_H1 (out), KeySwIn_H2 (out), KeySwIn_H3 (out), KeySwIn_H4 (out), KeySwIn_H5 (out)

### Nets
+3.3V_S: R13.2 R14.2 R15.2 R16.2 R17.2 R23.2 R24.2 R25.2 R26.2 R31.2 R32.2 R33.2 R34.2 R39.2 R40.2 R41.2 R42.2 R47.2 R48.2 R49.2 R50.2
SGND: C27.2 C28.2 C29.2 C30.2 C31.2 C32.2 C33.2 C34.2 C35.2 C36.2 C37.2 C38.2 C39.2 C40.2 C41.2 C42.2 C43.2 C44.2 C45.2 C46.2 C47.2 J1.6 J4.9 J5.9
KeySwIn_H1: C27.1 J1.1 R13.1 ; port KeySwIn_H1
KeySwIn_H2: C28.1 J1.2 R14.1 ; port KeySwIn_H2
KeySwIn_H3: C29.1 J1.3 R15.1 ; port KeySwIn_H3
KeySwIn_H4: C30.1 J1.4 R16.1 ; port KeySwIn_H4
KeySwIn_H5: C31.1 J1.5 R17.1 ; port KeySwIn_H5
KJ_A1: C32.1 J4.1 R23.1 ; port KeySwIn_A1
KJ_A2: C36.1 J4.2 R31.1 ; port KeySwIn_A2
KJ_A3: C40.1 J4.3 R39.1 ; port KeySwIn_A3
KJ_A4: C44.1 J4.4 R47.1 ; port KeySwIn_A4
KJ_A5: C33.1 J4.5 R24.1 ; port KeySwIn_A5
KJ_A6: C37.1 J4.6 R32.1 ; port KeySwIn_A6
KJ_A7: C41.1 J4.7 R40.1 ; port KeySwIn_A7
KJ_A8: C45.1 J4.8 R48.1 ; port KeySwIn_A8
KJ_B1: C34.1 J5.1 R25.1 ; port KeySwIn_B1
KJ_B2: C38.1 J5.2 R33.1 ; port KeySwIn_B2
KJ_B3: C42.1 J5.3 R41.1 ; port KeySwIn_B3
KJ_B4: C46.1 J5.4 R49.1 ; port KeySwIn_B4
KJ_B5: C35.1 J5.5 R26.1 ; port KeySwIn_B5
KJ_B6: C39.1 J5.6 R34.1 ; port KeySwIn_B6
KJ_B7: C43.1 J5.7 R42.1 ; port KeySwIn_B7
KJ_B8: C47.1 J5.8 R50.1 ; port KeySwIn_B8

### Library data of the parts
C27-C47 = Cap: Capacitor; Value: 22pF; Published: 8-Jun-2000; Revision: July-2002: Re-released for DXP Platform.; Publisher: Altium Limited
J1 = HEADER1X6
J4 J5 = Header 9: Header, 9-Pin; LatestRevisionDate: 17-Jul-2002; LatestRevisionNote: Re-released for DXP Platform.; Publisher: Altium Limited
R13-R17 R23-R26 R31-R34 R39-R42 R47-R50 = RES: Resistor; Published: 8-Jun-2000; LatestRevisionDate: 17-Jul-2002; LatestRevisionNote: Re-released for DXP Platform.; PackageReference: AXIAL-0.3; Publisher: Altium Limited; Value: 4.7K

## Sheet OmapSystem.SchDoc
size A4
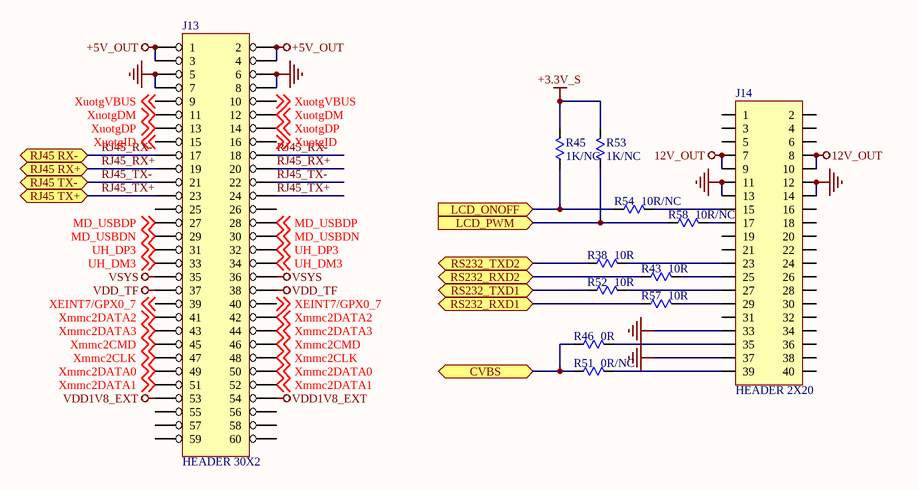
[diagram p5: OmapSystem.SchDoc]

### Parts
J13  HEADER 30X2  [HD2X30-2.00]
J14  HEADER 2X20  [HD2X20-2.00]
R38  10R  [R0805]
R43  10R  [R0805]
R45  1K/NC  [R0805]
R46  0R  [R0805]
R51  0R/NC  [R0805]
R52  10R  [R0805]
R53  1K/NC  [R0805]
R54  10R/NC  [R0805]
R57  10R  [R0805]
R58  10R/NC  [R0805]

### Ports
CVBS (bidir), LCD_ONOFF (in), LCD_PWM (in), RJ45 RX+ (bidir), RJ45 RX- (bidir), RJ45 TX+ (bidir), RJ45 TX- (bidir), RS232_RXD1 (bidir), RS232_RXD2 (bidir), RS232_TXD1 (bidir), RS232_TXD2 (bidir)

### Nets
12V_OUT: J14.7 J14.8 J14.9 J14.10
+3.3V_S: R45.1 R53.1
+5V_OUT: J13.1 J13.2 J13.3 J13.4
SGND: J13.5 J13.6 J13.7 J13.8 J14.11 J14.12 J14.13 J14.14 J14.33 J14.37
VDD1V8_EXT: J13.53 J13.54
VDD_TF: J13.37 J13.38
VSYS: J13.35 J13.36
CVBS: R46.2 R51.2 ; port CVBS
LCD_ONOFF: R45.2 R54.2 ; port LCD_ONOFF
LCD_PWM: R53.2 R58.2 ; port LCD_PWM
MD_USBDN: J13.29 J13.30 ; off-sheet MD_USBDN
MD_USBDP: J13.27 J13.28 ; off-sheet MD_USBDP
RJ45_RX+: J13.19 J13.20 ; port RJ45 RX+
RJ45_RX-: J13.17 J13.18 ; port RJ45 RX-
RJ45_TX+: J13.23 J13.24 ; port RJ45 TX+
RJ45_TX-: J13.21 J13.22 ; port RJ45 TX-
RS232_RXD1: R57.2 ; port RS232_RXD1
RS232_RXD2: R43.2 ; port RS232_RXD2
RS232_TXD1: R52.2 ; port RS232_TXD1
RS232_TXD2: R38.2 ; port RS232_TXD2
UH_DM3: J13.33 J13.34 ; off-sheet UH_DM3
UH_DP3: J13.31 J13.32 ; off-sheet UH_DP3
XEINT7/GPX0_7: J13.39 J13.40 ; off-sheet XEINT7/GPX0_7
Xmmc2CLK: J13.47 J13.48 ; off-sheet Xmmc2CLK
Xmmc2CMD: J13.45 J13.46 ; off-sheet Xmmc2CMD
Xmmc2DATA0: J13.49 J13.50 ; off-sheet Xmmc2DATA0
Xmmc2DATA1: J13.51 J13.52 ; off-sheet Xmmc2DATA1
Xmmc2DATA2: J13.41 J13.42 ; off-sheet Xmmc2DATA2
Xmmc2DATA3: J13.43 J13.44 ; off-sheet Xmmc2DATA3
XuotgDM: J13.11 J13.12 ; off-sheet XuotgDM
XuotgDP: J13.13 J13.14 ; off-sheet XuotgDP
XuotgID: J13.15 J13.16 ; off-sheet XuotgID
XuotgVBUS: J13.9 J13.10 ; off-sheet XuotgVBUS
NetJ14_15: J14.15 R54.1
NetJ14_17: J14.17 R58.1
NetJ14_23: J14.23 R38.1
NetJ14_25: J14.25 R43.1
NetJ14_27: J14.27 R52.1
NetJ14_29: J14.29 R57.1
NetJ14_35: J14.35 R46.1
NetJ14_39: J14.39 R51.1

Not connected (* = marked no-connect by the designer): J13 25 26 55 56 57 58 59 60; J14 1 2 3 4 5 6 16 18 19 20 21 22 24 26 28 30 31 32 34 36 38 40

### Library data of the parts
R38 R43 R45 R46 R51-R54 R57 R58 = Res: Resistor; Published: 8-Jun-2000; LatestRevisionDate: 04-Mar-2005; LatestRevisionNote: PCB Footprint replaced.; PackageReference: J1-0603; Publisher: Altium Limited
  R38 R43 R52 R57: Value: 10R
  R45 R53: Value: 1K/NC
  R46: Value: 0R
  R51: Value: 0R/NC
  R54 R58: Value: 10R/NC

## Sheet KeyInput_MG.SchDoc
size A4
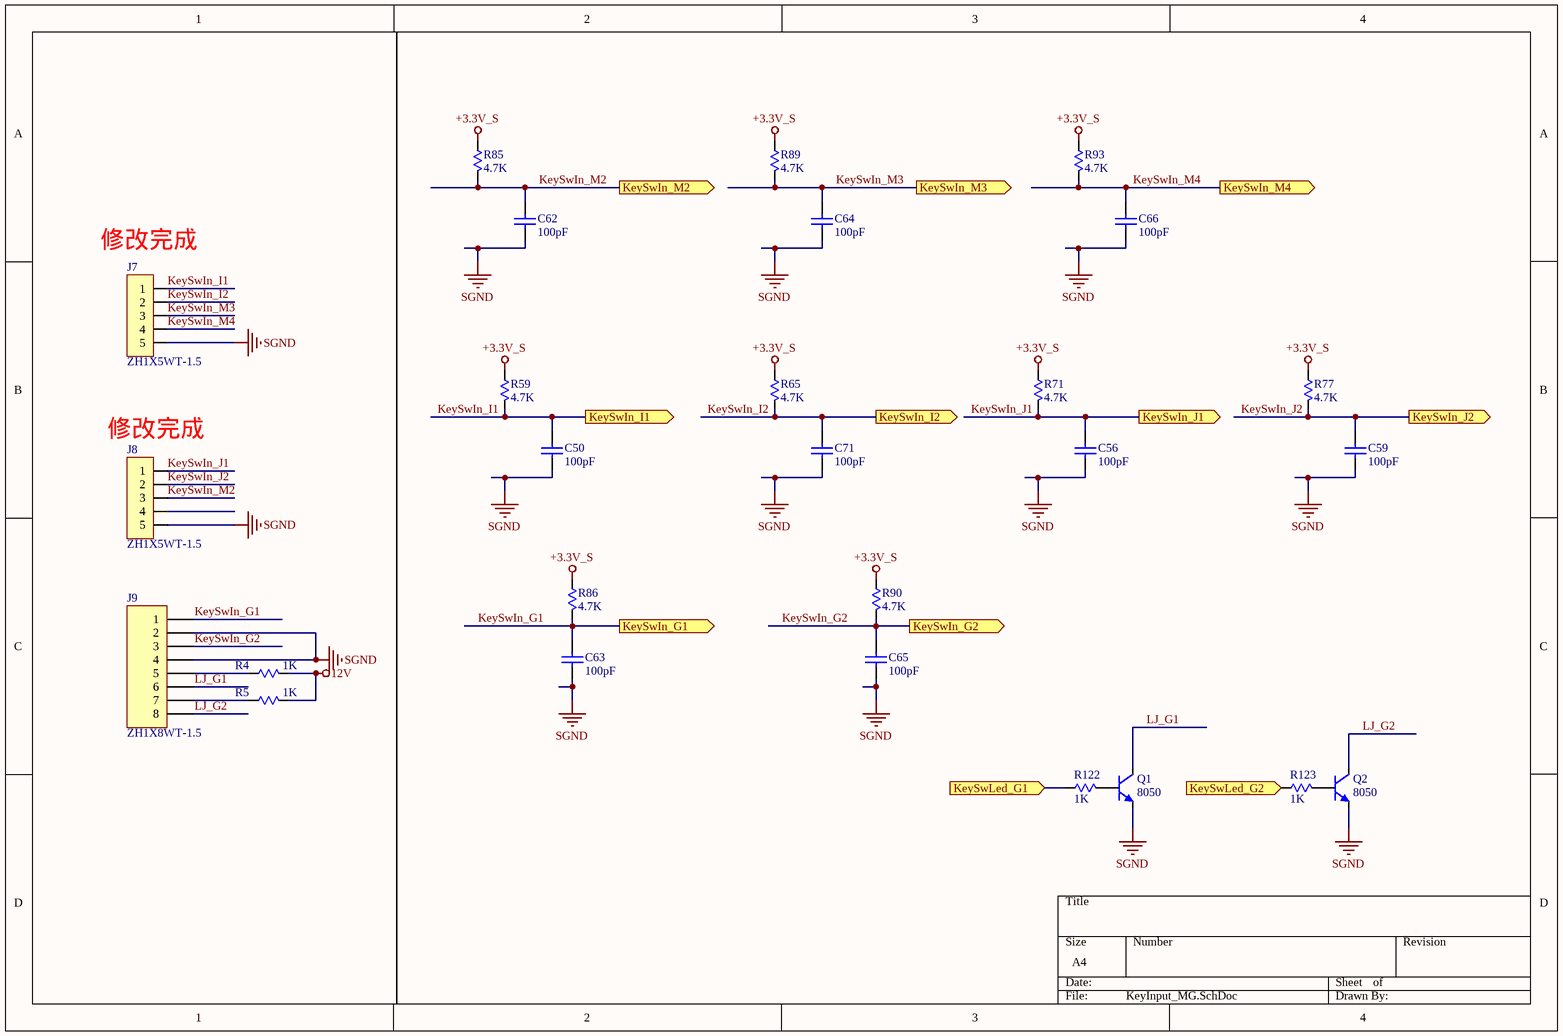
[diagram p6: KeyInput_MG.SchDoc]

### Parts
C50  100pF  [C0805]
C56  100pF  [C0805]
C59  100pF  [C0805]
C62  100pF  [C0805]
C63  100pF  [C0805]
C64  100pF  [C0805]
C65  100pF  [C0805]
C66  100pF  [C0805]
C71  100pF  [C0805]
J7  ZH1X5WT-1.5  [ZH1X5WT-1.5]
J8  ZH1X5WT-1.5  [ZH1X5WT-1.5]
J9  ZH1X8WT-1.5  [ZH1X8WT-1.5]
Q1  8050  [SOT-23]
Q2  8050  [SOT-23]
R4  1K  [R0805]
R5  1K  [R0805]
R59  4.7K  [R0805]
R65  4.7K  [R0805]
R71  4.7K  [R0805]
R77  4.7K  [R0805]
R85  4.7K  [R0805]
R86  4.7K  [R0805]
R89  4.7K  [R0805]
R90  4.7K  [R0805]
R93  4.7K  [R0805]
R122  1K  [R0805]
R123  1K  [R0805]

### Ports
KeySwIn_G1 (out), KeySwIn_G2 (out), KeySwIn_I1 (out), KeySwIn_I2 (out), KeySwIn_J1 (out), KeySwIn_J2 (out), KeySwIn_M2 (out), KeySwIn_M3 (out), KeySwIn_M4 (out), KeySwLed_G1 (in), KeySwLed_G2 (in)

### Nets
12V: R4.1 R5.1
+3.3V_S: R59.2 R65.2 R71.2 R77.2 R85.2 R86.2 R89.2 R90.2 R93.2
SGND: C50.2 C56.2 C59.2 C62.2 C63.2 C64.2 C65.2 C66.2 C71.2 J7.5 J8.5 J9.2 J9.4 Q1.2(E) Q2.2(E)
KeySwIn_G1: C63.1 J9.1 R86.1 ; port KeySwIn_G1
KeySwIn_G2: C65.1 J9.3 R90.1 ; port KeySwIn_G2
KeySwIn_I1: C50.1 J7.1 R59.1 ; port KeySwIn_I1
KeySwIn_I2: C71.1 J7.2 R65.1 ; port KeySwIn_I2
KeySwIn_J1: C56.1 J8.1 R71.1 ; port KeySwIn_J1
KeySwIn_J2: C59.1 J8.2 R77.1 ; port KeySwIn_J2
KeySwIn_M2: C62.1 J8.3 R85.1 ; port KeySwIn_M2
KeySwIn_M3: C64.1 J7.3 R89.1 ; port KeySwIn_M3
KeySwIn_M4: C66.1 J7.4 R93.1 ; port KeySwIn_M4
KeySwLed_G1: R122.2 ; port KeySwLed_G1
KeySwLed_G2: R123.2 ; port KeySwLed_G2
LJ_G1: J9.6 Q1.3(C)
LJ_G2: J9.8 Q2.3(C)
NetJ9_5: J9.5 R4.2
NetJ9_7: J9.7 R5.2
NetQ1_1: Q1.1(B) R122.1
NetQ2_1: Q2.1(B) R123.1

Not connected (* = marked no-connect by the designer): J8 4

### Notes on the sheet
- (near J7) 修改完成
- (near J8) 修改完成

### Library data of the parts
C50 C56 C59 C62-C66 C71 = Cap: Capacitor; Value: 22pF; Published: 8-Jun-2000; Revision: July-2002: Re-released for DXP Platform.; Publisher: Altium Limited
J7 J8 = HEADER1X5
J9 = Header 8: Header, 8-Pin; LatestRevisionDate: 17-Jul-2002; LatestRevisionNote: Re-released for DXP Platform.; Publisher: Altium Limited
Q1 Q2 = NPN: NPN General Purpose Amplifier; Published: 8-Jun-2000; LatestRevisionDate: 15-Jan-2003; LatestRevisionNote: PCB Footprint 'BCY-W3/D4.7' replaced; DatasheetDocument: 1997; PackageDocument: Sep-1998; PackageReference: TO-92A; Publisher: Altium Limited; Code_JEDEC: TO-92A; ComponentLink1Description: Manufacturer Link; ComponentLink1URL: http://www.fairchildsemi.com/; ComponentLink2Description: Datasheet; ComponentLink2URL: http://www.fairchildsemi.com/ds/2N%2F2N3904.pdf
R4 R5 R59 R65 R71 R77 R85 R86 R89 R90 R93 R122 R123 = RES: Resistor; Published: 8-Jun-2000; LatestRevisionDate: 17-Jul-2002; LatestRevisionNote: Re-released for DXP Platform.; PackageReference: AXIAL-0.3; Publisher: Altium Limited
  R4 R5 R122 R123: Value: 1K
  R59 R65 R71 R77 R85 R86 R89 R90 R93: Value: 4.7K

## Sheet PowerManager.SchDoc
size A4
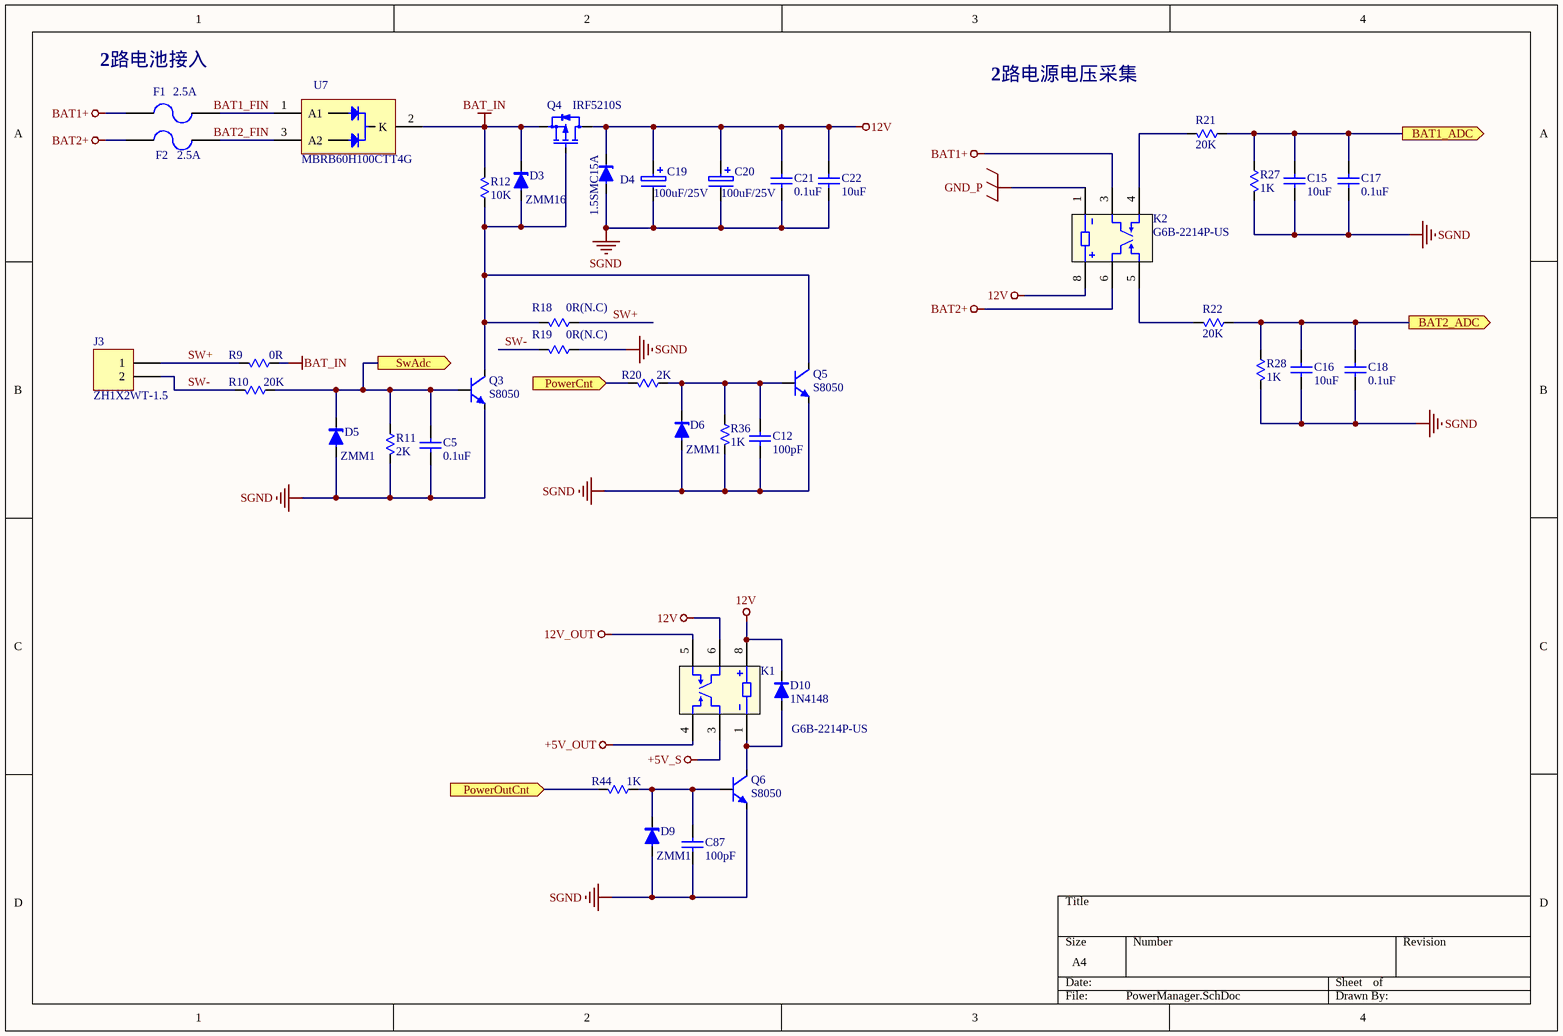
[diagram p7: PowerManager.SchDoc]

### Parts
C5  0.1uF  [C0805]
C12  100pF  [C0805]
C15  10uF  [C0805]
C16  10uF  [C0805]
C17  0.1uF  [C0805]
C18  0.1uF  [C0805]
C19  100uF/25V  [CT7343-E-S]
C20  100uF/25V  [CT7343-E-S]
C21  0.1uF  [C0805]
C22  10uF  [C0805]
C87  100pF  [C0805]
D3  ZMM16  [SOD-80]
D4  1.5SMC15A  [SMC]
D5  ZMM1  [SOD-80]
D6  ZMM1  [SOD-80]
D9  ZMM1  [SOD-80]
D10  1N4148  [SOD-80]
F1  2.5A  [F1812]
F2  2.5A  [F1812]
J3  ZH1X2WT-1.5  [ZH1X2WT-1.5]
K1  G6B-2214P-US  [G6B-2214P-Us]
K2  G6B-2214P-US  [G6B-2214P-Us]
Q3  S8050  [SOT-23]
Q4  IRF5210S  [TO-262]
Q5  S8050  [SOT-23]
Q6  S8050  [SOT-23]
R9  0R  [R0805]
R10  20K  [R0805]
R11  2K  [R0805]
R12  10K  [R0805]
R18  0R(N.C)  [R0805]
R19  0R(N.C)  [R0805]
R20  2K  [R0805]
R21  20K  [R0805]
R22  20K  [R0805]
R27  1K  [R0805]
R28  1K  [R0805]
R36  1K  [R0805]
R44  1K  [R0805]
U7  MBRB60H100CTT4G  [TO-262]

### Ports
BAT1_ADC (out), BAT2_ADC (out), PowerCnt (in), PowerOutCnt (in), SwAdc (out)

### Nets
12V: C19.1 C20.1 C21.2 C22.2 D4.2(K) D10.2(K) K1.6 K1.8 K2.8 Q4.2(D)
12V_OUT: K1.5
+5V_OUT: K1.4
+5V_S: K1.3
BAT1+: F1.1 K2.3
BAT2+: F2.1 K2.6
BAT_IN: D3.2(K) Q4.3(S) R9.2 R12.1 U7.2(K)
GND_P: K2.1
SGND: C5.1 C12.1 C15.2 C16.2 C17.2 C18.2 C19.2 C20.2 C21.1 C22.1 C87.1 D4.1(A) D5.1(A) D6.1(A) D9.1(A) Q3.2(E) Q5.2(E) Q6.2(E) R11.1 R19.1 R27.1 R28.1 R36.1
BAT1_ADC: C15.1 C17.1 R21.2 R27.2 ; port BAT1_ADC
BAT2_ADC: C16.1 C18.1 R22.2 R28.2 ; port BAT2_ADC
PowerCnt: R20.1 ; port PowerCnt
PowerOutCnt: R44.1 ; port PowerOutCnt
SW+: J3.1 R9.1 R18.1
SW-: J3.2 R10.1 R19.2
SwAdc: C5.2 D5.2(K) Q3.1(B) R10.2 R11.2 ; port SwAdc
NetC12_2: C12.2 D6.2(K) Q5.1(B) R20.2 R36.2
NetC87_2: C87.2 D9.2(K) Q6.1(B) R44.2
NetD3_1: D3.1(A) Q3.3(C) Q4.1(G) Q5.3(C) R12.2 R18.2
NetD10_1: D10.1(A) K1.1 Q6.3(C)
NetF1_2: F1.2 U7.1(A1)
NetF2_2: F2.2 U7.3(A2)
NetK2_4: K2.4 R21.1
NetK2_5: K2.5 R22.1

### Notes on the sheet
- (near F1) 2路电池接入
- 2路电源电压采集
- Labels drawn without touching a wire or pin: BAT1_FIN, BAT2_FIN

### Library data of the parts
C5 C12 C21 C22 C87 = Cap: Capacitor; Value: 22pF; Published: 8-Jun-2000; Revision: July-2002: Re-released for DXP Platform.; Publisher: Altium Limited
C15-C18 = CAP: Published: 8-Jun-2000; LatestRevisionDate: 17-Jul-2002; LatestRevisionNote: Re-released for DXP Platform.; PackageReference: RAD-0.3; Publisher: Altium Limited
  C15 C16: Value: 10uF
  C17 C18: Value: 0.1uF
C19 C20 = ELECTRO: Electrolytic Capacitor
D3-D6 D9 = DIODE-ZENER: Small Signal Zener Diodes
D10 = DIODE-SWITCHING: Silicon Epitaxial Planar Diodes
F1 F2 = FUSE2: Fuse
J3 = Header 2: Header, 2-Pin; LatestRevisionDate: 17-Jul-2002; LatestRevisionNote: Re-released for DXP Platform.; Publisher: Altium Limited
Q3 Q5 Q6 = NPN: NPN General Purpose Amplifier; Published: 8-Jun-2000; LatestRevisionDate: 15-Jan-2003; LatestRevisionNote: PCB Footprint 'BCY-W3/D4.7' replaced; DatasheetDocument: 1997; PackageDocument: Sep-1998; PackageReference: TO-92A; Publisher: Altium Limited; Code_JEDEC: TO-92A; ComponentLink1Description: Manufacturer Link; ComponentLink1URL: http://www.fairchildsemi.com/; ComponentLink2Description: Datasheet; ComponentLink2URL: http://www.fairchildsemi.com/ds/2N%2F2N3904.pdf
Q4 = PMOS: P-Channel 30-V (D-S), 150 C MOSFET
R9-R12 R20 R36 R44 = Res: Resistor; Published: 8-Jun-2000; LatestRevisionDate: 04-Mar-2005; LatestRevisionNote: PCB Footprint replaced.; PackageReference: J1-0603; Publisher: Altium Limited
  R9: Value: 0R
  R10: Value: 20K
  R11 R20: Value: 2K
  R12: Value: 10K
  R36 R44: Value: 1K
R18 R19 R21 R22 R27 R28 = RES: Resistor; Published: 8-Jun-2000; LatestRevisionDate: 17-Jul-2002; LatestRevisionNote: Re-released for DXP Platform.; PackageReference: AXIAL-0.3; Publisher: Altium Limited
  R18 R19: Value: 0R(N.C)
  R21 R22: Value: 20K
  R27 R28: Value: 1K
U7 = VB30200C

## Sheet LeftInterface.SchDoc
size A4
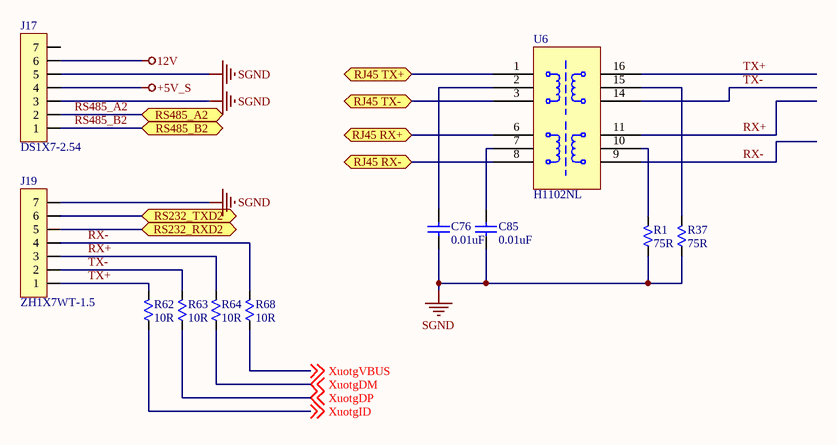
[diagram p8: LeftInterface.SchDoc]

### Parts
C76  0.01uF  [C0805]
C85  0.01uF  [C0805]
J17  DS1X7-2.54  [DS1X7H-2.54]
J19  ZH1X7WT-1.5  [ZH1X7WT-1.5]
R1  75R  [R0805]
R37  75R  [R0805]
R62  10R  [R0805]
R63  10R  [R0805]
R64  10R  [R0805]
R68  10R  [R0805]
U6  H1102NL  [SOP16]

### Ports
RJ45 RX+ (bidir), RJ45 RX- (bidir), RJ45 TX+ (bidir), RJ45 TX- (bidir), RS232_RXD2 (bidir), RS232_TXD2 (bidir), RS485_A2 (bidir), RS485_B2 (bidir)

### Nets
12V: J17.6
+5V_S: J17.4
SGND: C76.2 C85.2 J17.3 J17.5 J19.7 R1.2 R37.2
RJ45_RX+: U6.6 ; port RJ45 RX+
RJ45_RX-: U6.8 ; port RJ45 RX-
RJ45_TX+: U6.1 ; port RJ45 TX+
RJ45_TX-: U6.3 ; port RJ45 TX-
RS232_RXD2: J19.5 ; port RS232_RXD2
RS232_TXD2: J19.6 ; port RS232_TXD2
RS485_A2: J17.2 ; port RS485_A2
RS485_B2: J17.1 ; port RS485_B2
RX+: J19.3 R64.1 U6.11
RX-: J19.4 R68.1 U6.9
TX+: J19.1 R62.1 U6.16
TX-: J19.2 R63.1 U6.14
XuotgDM: R64.2 ; off-sheet XuotgDM
XuotgDP: R63.2 ; off-sheet XuotgDP
XuotgID: R62.2 ; off-sheet XuotgID
XuotgVBUS: R68.2 ; off-sheet XuotgVBUS
NetC76_1: C76.1 U6.2
NetC85_1: C85.1 U6.7
NetR1_1: R1.1 U6.10
NetR37_1: R37.1 U6.15

Not connected (* = marked no-connect by the designer): J17 7

### Library data of the parts
C76 C85 = Cap: Capacitor; Value: 22pF; Published: 8-Jun-2000; Revision: July-2002: Re-released for DXP Platform.; Publisher: Altium Limited
J17 J19 = HEADER1X7
R1 R37 R62-R64 R68 = Res: Resistor; Published: 8-Jun-2000; LatestRevisionDate: 04-Mar-2005; LatestRevisionNote: PCB Footprint replaced.; PackageReference: J1-0603; Publisher: Altium Limited
  R1 R37: Value: 75R
  R62-R64 R68: Value: 10R

## Sheet TTL_TO_RS232.SchDoc
size A4
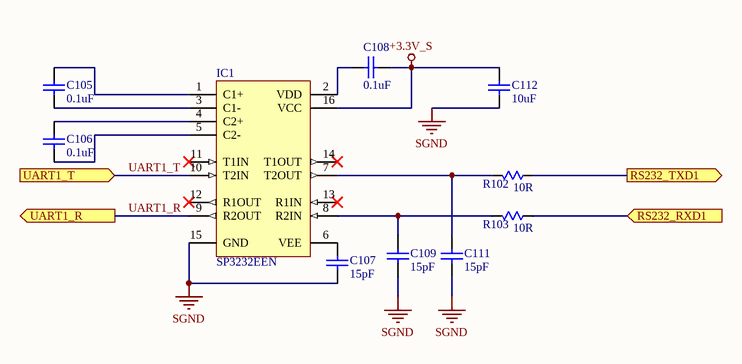
[diagram p9: TTL_TO_RS232.SchDoc]

### Parts
C105  0.1uF  [C0805]
C106  0.1uF  [C0805]
C107  15pF  [C0805]
C108  0.1uF  [C0805]
C109  15pF  [C0805]
C111  15pF  [C0805]
C112  10uF  [C1206]
IC1  SP3232EEN  [SO16-150]
R102  10R  [R0805]
R103  10R  [R0805]

### Ports
RS232_RXD1 (in), RS232_TXD1 (out), UART1_R (out), UART1_T (in)

### Nets
+3.3V_S: C108.1 C112.2 IC1.16(VCC)
SGND: C107.2 C109.2 C111.2 C112.1 IC1.15(GND)
RS232_RXD1: R103.2 ; port RS232_RXD1
RS232_TXD1: R102.2 ; port RS232_TXD1
UART1_R: IC1.9(R2OUT) ; port UART1_R
UART1_T: IC1.10(T2IN) ; port UART1_T
NetC105_1: C105.1 IC1.3(C1-)
NetC105_2: C105.2 IC1.1(C1+)
NetC106_1: C106.1 IC1.5(C2-)
NetC106_2: C106.2 IC1.4(C2+)
NetC107_1: C107.1 IC1.6(VEE)
NetC108_2: C108.2 IC1.2(VDD)
NetC109_1: C109.1 IC1.8(R2IN) R103.1
NetC111_1: C111.1 IC1.7(T2OUT) R102.1

Not connected (* = marked no-connect by the designer): IC1 11(T1IN)* 12(R1OUT)* 13(R1IN)* 14(T1OUT)*

### Library data of the parts
C105 C106 C108 C112 = CAP: Published: 8-Jun-2000; LatestRevisionDate: 17-Jul-2002; LatestRevisionNote: Re-released for DXP Platform.; PackageReference: RAD-0.3; Publisher: Altium Limited
  C105 C106 C108: Value: 0.1uF
  C112: Value: 10uF
C107 C109 C111 = Cap: Capacitor; Published: 8-Jun-2000; Revision: July-2002: Re-released for DXP Platform.; Publisher: Altium Limited; Value: 15pF
IC1 = MAX232ACPE: +5V Powered, Multi-Channel RS-232 Driver/Receiver; Manufacturer: Maxim; Class: Communication; SubClass: Transceiver; Published: 16/01/2001; Publisher: Altium Hobart Technology Centre
R102 = RES: Resistor; Published: 8-Jun-2000; LatestRevisionDate: 04-Mar-2005; LatestRevisionNote: PCB Footprint replaced.; PackageReference: J1-0603; Publisher: Altium Limited; Value: 10R
R103 = Res: Resistor; Published: 8-Jun-2000; LatestRevisionDate: 04-Mar-2005; LatestRevisionNote: PCB Footprint replaced.; PackageReference: J1-0603; Publisher: Altium Limited; Value: 10R

## Sheet TTL_TO_RS485.SchDoc
size A4
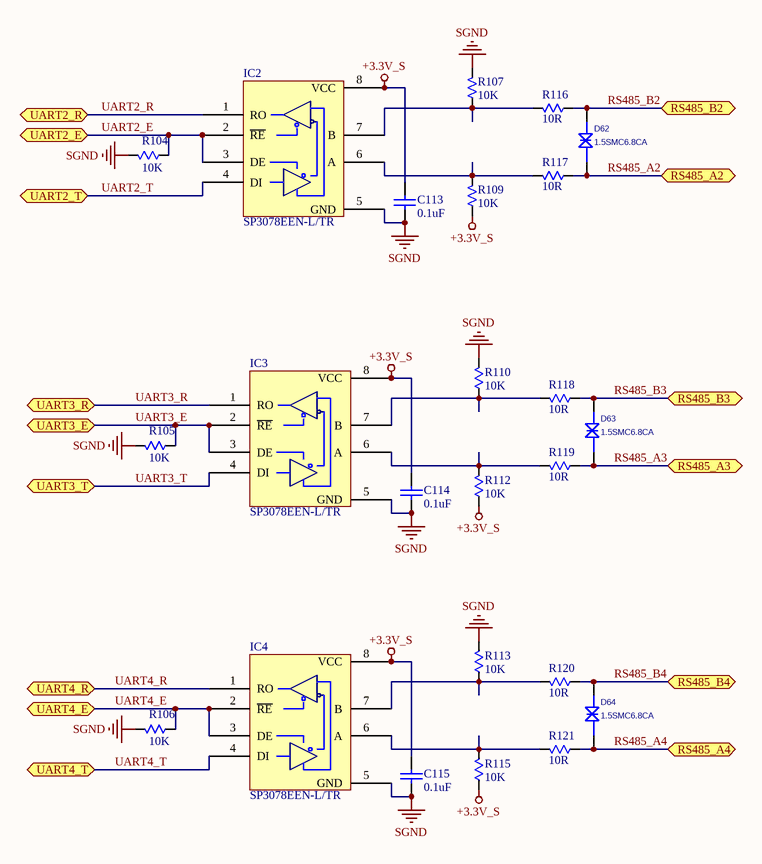
[diagram p10: TTL_TO_RS485.SchDoc]

### Parts
C113  0.1uF  [C0805]
C114  0.1uF  [C0805]
C115  0.1uF  [C0805]
D62  1.5SMC6.8CA  [SMB]
D63  1.5SMC6.8CA  [SMB]
D64  1.5SMC6.8CA  [SMB]
IC2  SP3078EEN-L/TR  [SO-8]
IC3  SP3078EEN-L/TR  [SO-8]
IC4  SP3078EEN-L/TR  [SO-8]
R104  10K  [R0805]
R105  10K  [R0805]
R106  10K  [R0805]
R107  10K  [R0805]
R109  10K  [R0805]
R110  10K  [R0805]
R112  10K  [R0805]
R113  10K  [R0805]
R115  10K  [R0805]
R116  10R  [R0805]
R117  10R  [R0805]
R118  10R  [R0805]
R119  10R  [R0805]
R120  10R  [R0805]
R121  10R  [R0805]

### Ports
RS485_A2 (bidir), RS485_A3 (bidir), RS485_A4 (bidir), RS485_B2 (bidir), RS485_B3 (bidir), RS485_B4 (bidir), UART2_E (bidir), UART2_R (bidir), UART2_T (bidir), UART3_E (bidir), UART3_R (bidir), UART3_T (bidir), UART4_E (bidir), UART4_R (bidir), UART4_T (bidir)

### Nets
+3.3V_S: C113.2 C114.2 C115.2 IC2.8(VCC) IC3.8(VCC) IC4.8(VCC) R109.1 R112.1 R115.1
SGND: C113.1 C114.1 C115.1 IC2.5(GND) IC3.5(GND) IC4.5(GND) R104.2 R105.2 R106.2 R107.2 R110.2 R113.2
RS485_A2: D62.2 R117.1 ; port RS485_A2
RS485_A3: D63.2 R119.1 ; port RS485_A3
RS485_A4: D64.2 R121.1 ; port RS485_A4
RS485_B2: D62.1 R116.1 ; port RS485_B2
RS485_B3: D63.1 R118.1 ; port RS485_B3
RS485_B4: D64.1 R120.1 ; port RS485_B4
UART2_E: IC2.2(~{RE}) IC2.3(DE) R104.1 ; port UART2_E
UART2_R: IC2.1(RO) ; port UART2_R
UART2_T: IC2.4(DI) ; port UART2_T
UART3_E: IC3.2(~{RE}) IC3.3(DE) R105.1 ; port UART3_E
UART3_R: IC3.1(RO) ; port UART3_R
UART3_T: IC3.4(DI) ; port UART3_T
UART4_E: IC4.2(~{RE}) IC4.3(DE) R106.1 ; port UART4_E
UART4_R: IC4.1(RO) ; port UART4_R
UART4_T: IC4.4(DI) ; port UART4_T
NetIC2_6: IC2.6(A) R109.2 R117.2
NetIC2_7: IC2.7(B) R107.1 R116.2
NetIC3_6: IC3.6(A) R112.2 R119.2
NetIC3_7: IC3.7(B) R110.1 R118.2
NetIC4_6: IC4.6(A) R115.2 R121.2
NetIC4_7: IC4.7(B) R113.1 R120.2

### Library data of the parts
C113-C115 = CAP: Published: 8-Jun-2000; LatestRevisionDate: 17-Jul-2002; LatestRevisionNote: Re-released for DXP Platform.; PackageReference: RAD-0.3; Publisher: Altium Limited; Value: 0.1uF
D62-D64 = P0080_1: Part Descriptions: Polymar ESD; Manufacturer: SemiTel; Part Type: ESD
IC2-IC4 = SP3078EEN
R104-R107 R109 R110 R112 R113 R115-R121 = RES: Resistor; Published: 8-Jun-2000; LatestRevisionDate: 17-Jul-2002; LatestRevisionNote: Re-released for DXP Platform.; PackageReference: AXIAL-0.3; Publisher: Altium Limited
  R104-R107 R109 R110 R112 R113 R115: Value: 10K
  R116-R121: Value: 10R

## Sheet PowerConvert.SchDoc
size A4
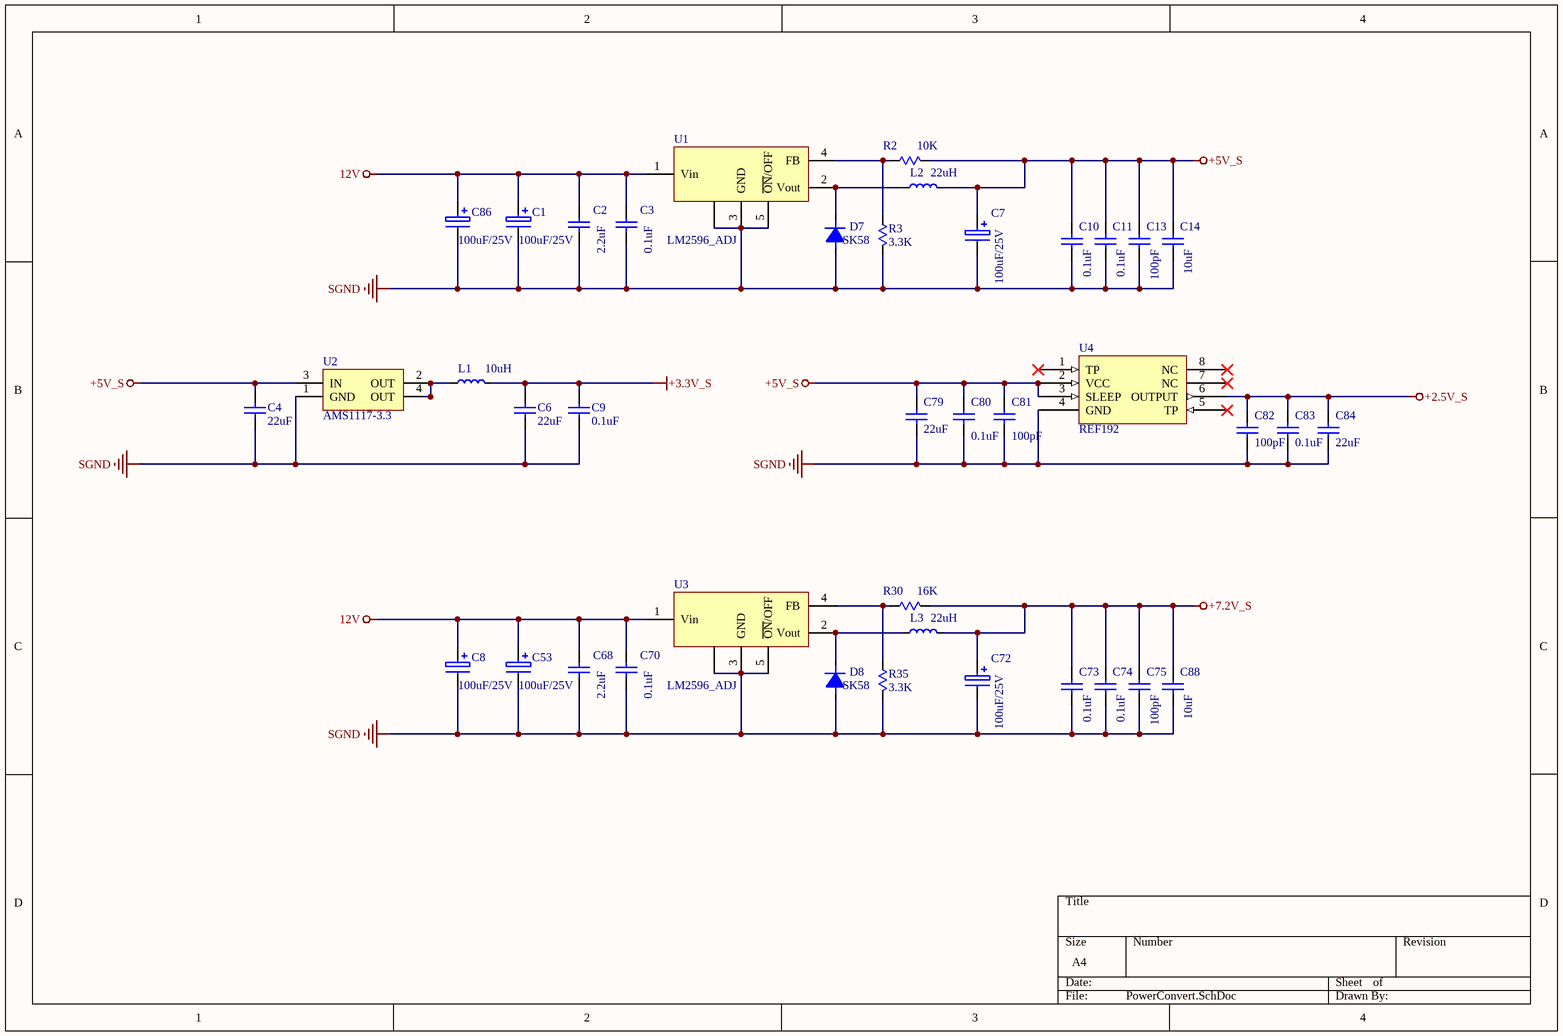
[diagram p11: PowerConvert.SchDoc]

### Parts
C1  100uF/25V  [CT7343-E-S]
C2  2.2uF  [C1206]
C3  0.1uF  [C0805]
C4  22uF  [C1206]
C6  22uF  [C1206]
C7  100uF/25V  [CT7343-E-S]
C8  100uF/25V  [CT7343-E-S]
C9  0.1uF  [C0805]
C10  0.1uF  [C0805]
C11  0.1uF  [C0805]
C13  100pF  [C0805]
C14  10uF  [C0805]
C53  100uF/25V  [CT7343-E-S]
C68  2.2uF  [C1206]
C70  0.1uF  [C0805]
C72  100uF/25V  [CT7343-E-S]
C73  0.1uF  [C0805]
C74  0.1uF  [C0805]
C75  100pF  [C0805]
C79  22uF  [C1206]
C80  0.1uF  [C0805]
C81  100pF  [C0805]
C82  100pF  [C0805]
C83  0.1uF  [C0805]
C84  22uF  [C1206]
C86  100uF/25V  [CT7343-E-S]
C88  10uF  [C0805]
D7  SK58  [SMB]
D8  SK58  [SMB]
L1  10uH  [L0805-C]
L2  22uH  [L5050-P]
L3  22uH  [L5050-P]
R2  10K  [R0805]
R3  3.3K  [R0805]
R30  16K  [R0805]
R35  3.3K  [R0805]
U1  LM2596_ADJ  [TO263]
U2  AMS1117-3.3  [SOT-223]
U3  LM2596_ADJ  [TO263]
U4  REF192  [SO-8]

### Nets
12V: C1.1 C2.2 C3.2 C8.1 C53.1 C68.2 C70.2 C86.1 U1.1(Vin) U3.1(Vin)
+2.5V_S: C82.2 C83.2 C84.2 U4.6(OUTPUT)
+3.3V_S: C6.1 C9.2 L1.1
+5V_S: C4.1 C7.1 C10.2 C11.2 C13.2 C14.2 C79.2 C80.2 C81.2 L2.1 R2.1 U2.3(IN) U4.2(VCC) U4.3(SLEEP)
+7.2V_S: C72.1 C73.2 C74.2 C75.2 C88.2 L3.1 R30.1
SGND: C1.2 C2.1 C3.1 C4.2 C6.2 C7.2 C8.2 C9.1 C10.1 C11.1 C13.1 C14.1 C53.2 C68.1 C70.1 C72.2 C73.1 C74.1 C75.1 C79.1 C80.1 C81.1 C82.1 C83.1 C84.1 C86.2 C88.1 D7.1(A) D8.1(A) R3.1 R35.1 U1.0(GND) U1.3(GND) U1.5(~{ON}/OFF) U2.1(GND) U3.0(GND) U3.3(GND) U3.5(~{ON}/OFF) U4.4(GND)
NetD7_2: D7.2(K) L2.2 U1.2(Vout)
NetD8_2: D8.2(K) L3.2 U3.2(Vout)
NetL1_2: L1.2 U2.2(OUT) U2.4(OUT)
NetR2_2: R2.2 R3.2 U1.4(FB)
NetR30_2: R30.2 R35.2 U3.4(FB)

Not connected (* = marked no-connect by the designer): U4 1(TP)* 5(TP)* 7(NC)* 8(NC)*

### Library data of the parts
C1 C7 C8 C53 C72 C86 = ELECTRO: Electrolytic Capacitor
C2-C4 C6 C9-C11 C13 C14 C68 C70 C73-C75 C79-C84 C88 = CAP: Published: 8-Jun-2000; LatestRevisionDate: 17-Jul-2002; LatestRevisionNote: Re-released for DXP Platform.; PackageReference: RAD-0.3; Publisher: Altium Limited
  C2 C68: Value: 2.2uF
  C3 C9-C11 C70 C73 C74 C80 C83: Value: 0.1uF
  C4 C6 C79 C84: Value: 22uF
  C13 C75 C81 C82: Value: 100pF
  C14 C88: Value: 10uF
D7 D8 = DIODE1: Diode
L1-L3 = INDUCTOR: Code_IEC: 1005; Published: 8-Jun-2000; LatestRevisionDate: 17-Jul-2002; LatestRevisionNote: Re-released for DXP Platform.; PackageReference: 0402-A; Publisher: Altium Limited; Code_JEITA: 0402
  L1: Value: 10uH
  L2 L3: Value: 22uH
R2 R3 R30 R35 = RES: Resistor; Published: 8-Jun-2000; LatestRevisionDate: 17-Jul-2002; LatestRevisionNote: Re-released for DXP Platform.; PackageReference: AXIAL-0.3; Publisher: Altium Limited
  R2: Value: 10K
  R3 R35: Value: 3.3K
  R30: Value: 16K
U1 U3 = LM2575
U2 = REG1117-3.3: 800mA and 1A Low Dropout Positive Regulator 2.85V, 3.3V, 5V, and Adjustable; Package Information: Latest Revision: revC; Published: 8-Jun-2000; Revision: 17-Jul-2002: Re-released for DXP Platform.; Datasheet: Latest Revision: Sep-1997; Package Reference: ZZ311; Publisher: Altium Limited
U4 = REF192/5/7

## Sheet DataVideoPort.SchDoc
size A4
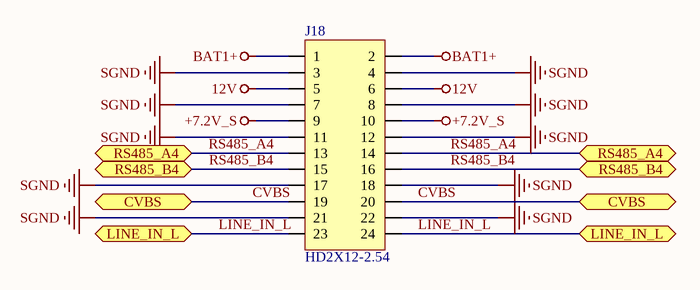
[diagram p12: DataVideoPort.SchDoc]

### Parts
J18  HD2X12-2.54  [HD2X12-2.54]

### Ports
CVBS (bidir), LINE_IN_L (bidir), RS485_A4 (bidir), RS485_B4 (bidir)

### Nets
12V: J18.5 J18.6
+7.2V_S: J18.9 J18.10
BAT1+: J18.1 J18.2
SGND: J18.3 J18.4 J18.7 J18.8 J18.11 J18.12 J18.17 J18.18 J18.21 J18.22
CVBS: J18.19 J18.20 ; port CVBS
LINE_IN_L: J18.23 J18.24 ; port LINE_IN_L
RS485_A4: J18.13 J18.14 ; port RS485_A4
RS485_B4: J18.15 J18.16 ; port RS485_B4

### Library data of the parts
J18 = HEADER2X12